# EAGLE design replicape-display (EAGLE 5.12)
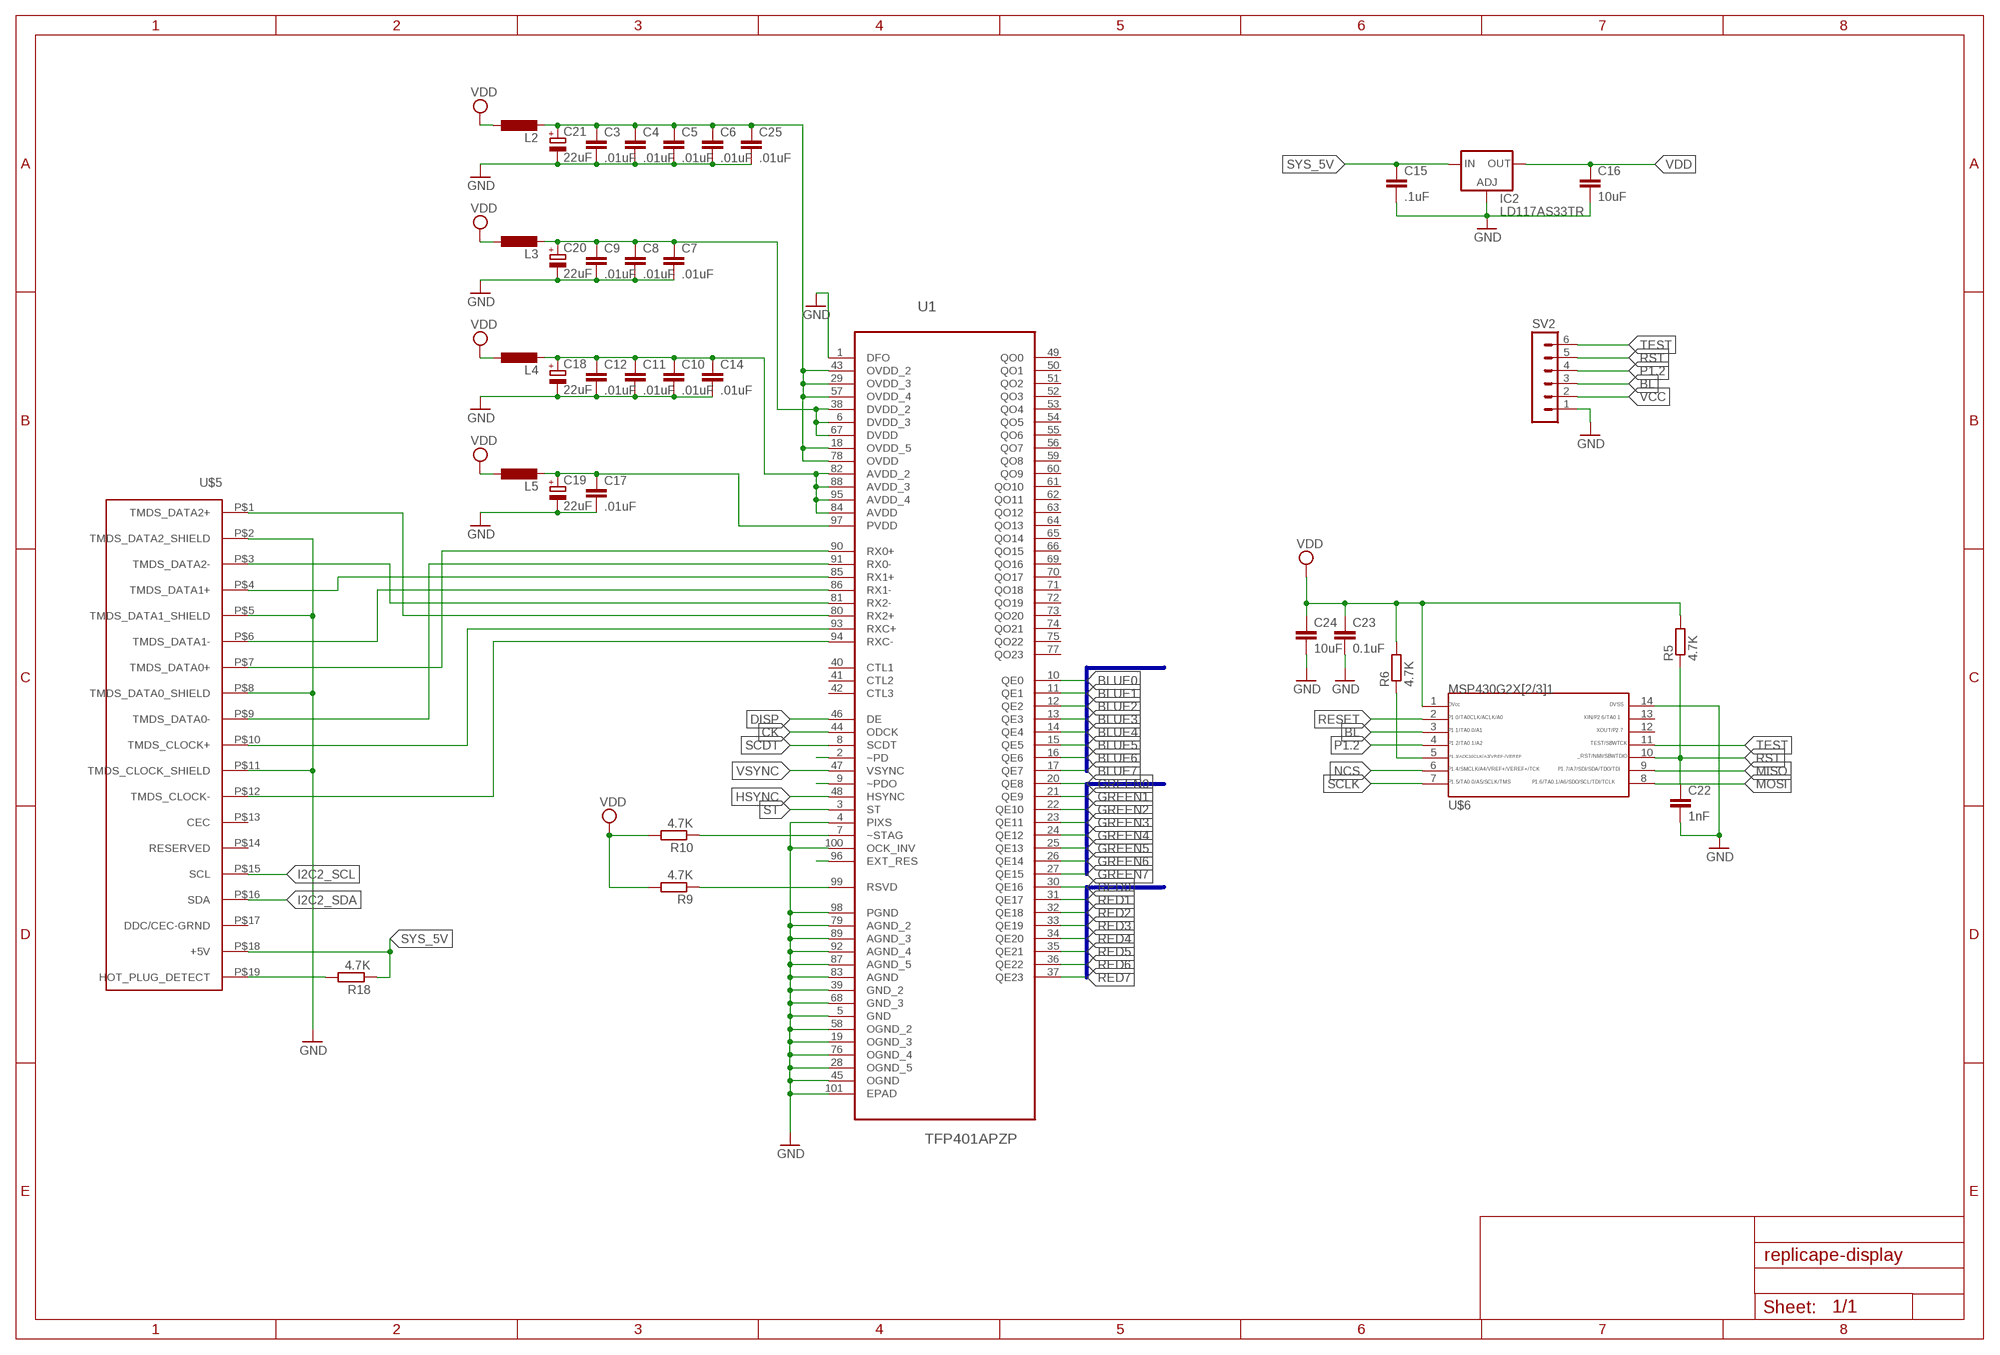
[diagram p0: schematic, sheet 1, part 1 of 2]
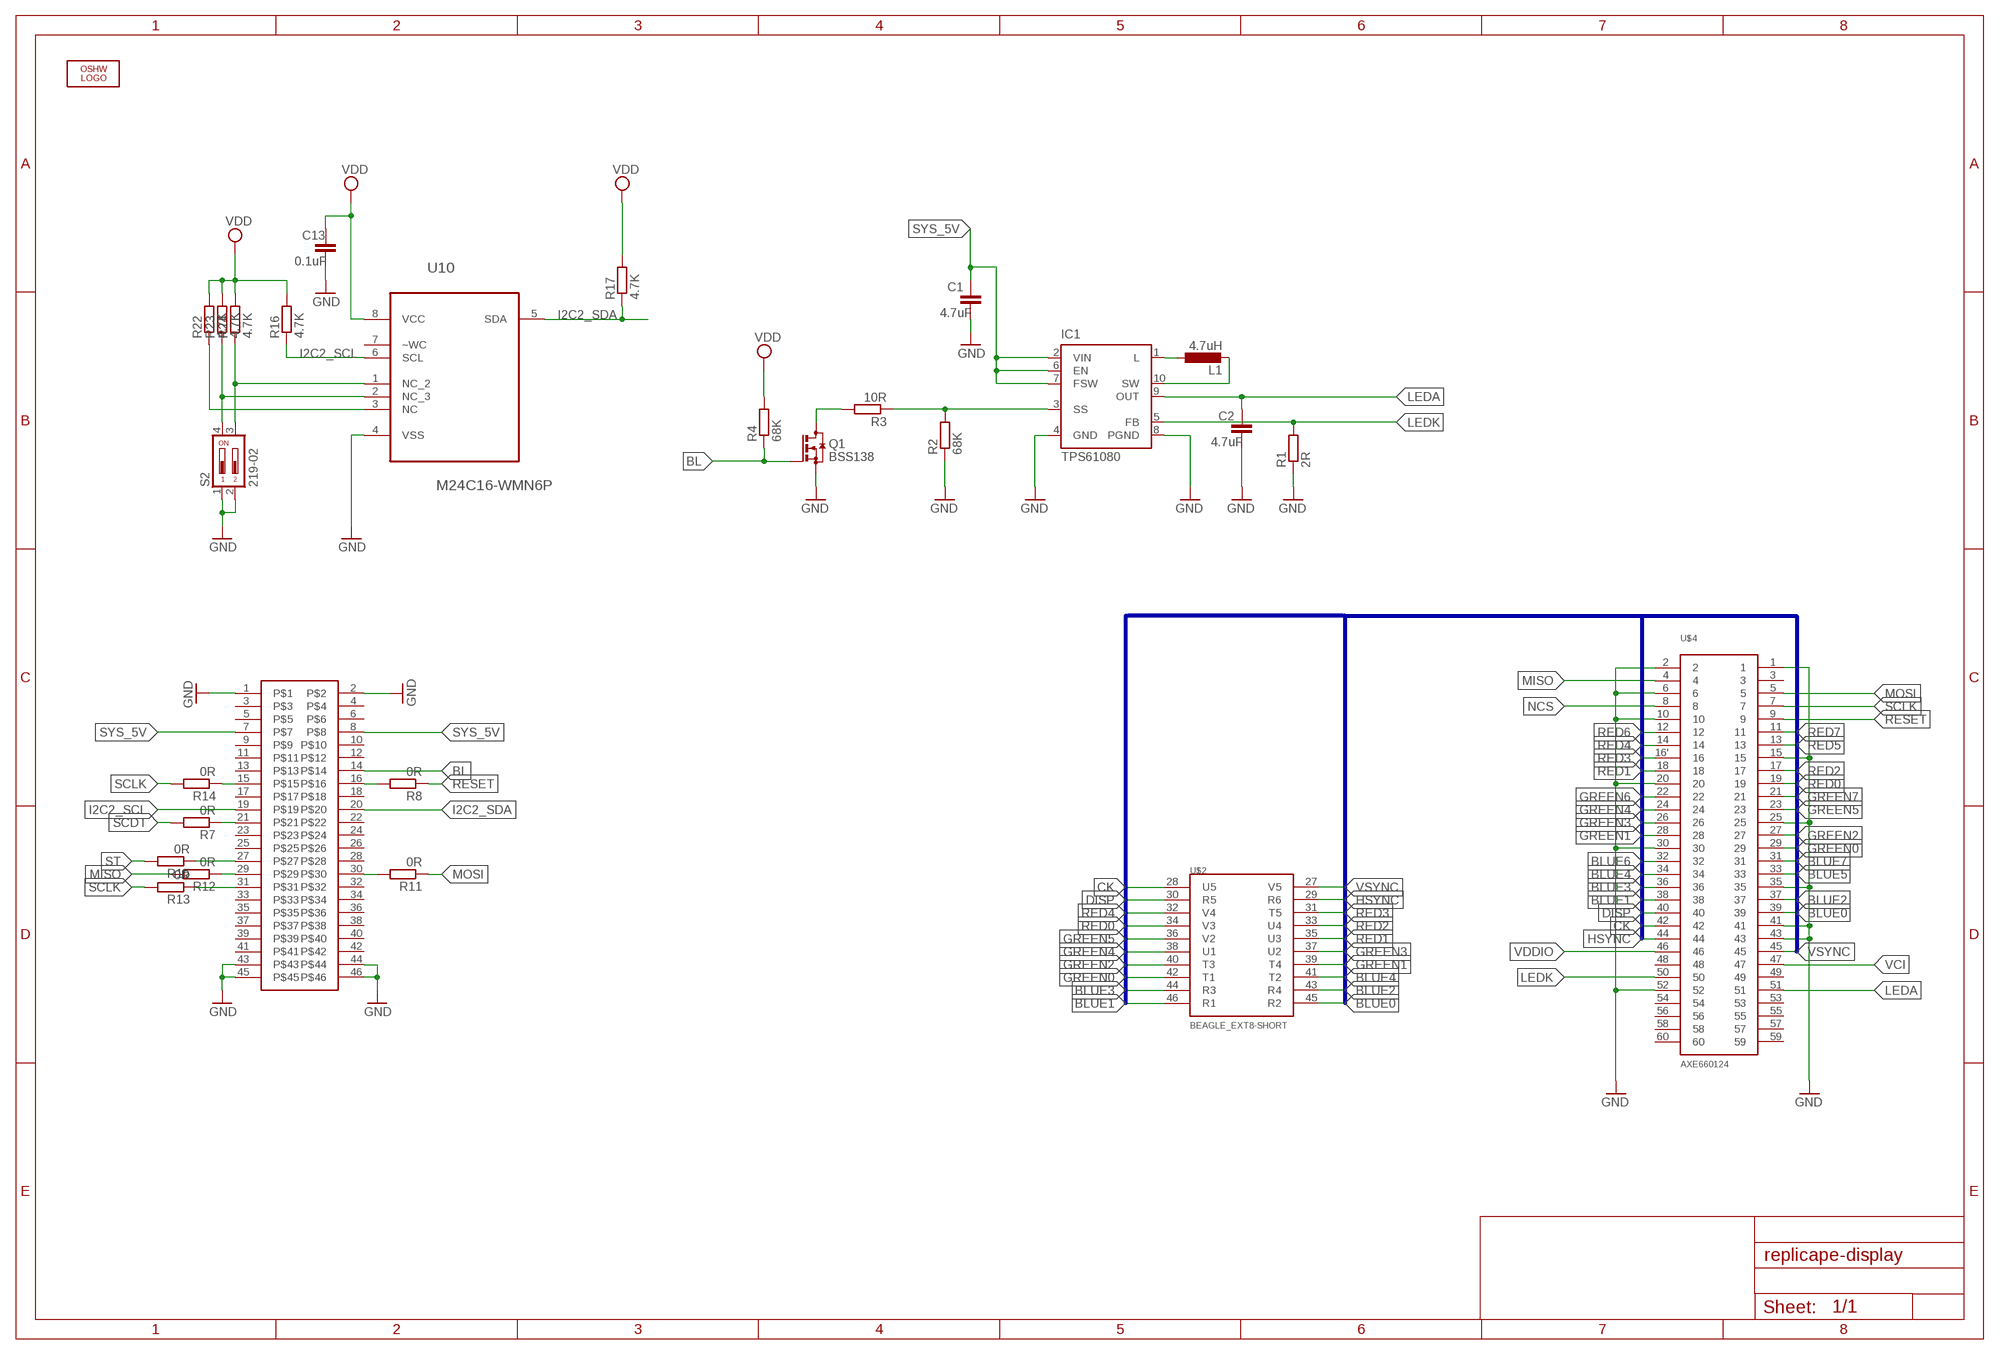
[diagram p1: schematic, sheet 1, part 2 of 2]

## Parts
C1  4.7uF  C-EUC0402  [C0402]
C2  4.7uF  C-EUC0402  [C0402]
C3  .01uF  C-EUC0402  [C0402]
C4  .01uF  C-EUC0402  [C0402]
C5  .01uF  C-EUC0402  [C0402]
C6  .01uF  C-EUC0402  [C0402]
C7  .01uF  C-EUC0402  [C0402]
C8  .01uF  C-EUC0402  [C0402]
C9  .01uF  C-EUC0402  [C0402]
C10  .01uF  C-EUC0402  [C0402]
C11  .01uF  C-EUC0402  [C0402]
C12  .01uF  C-EUC0402  [C0402]
C13  0.1uF  C-EUC0402  [C0402]
C14  .01uF  C-EUC0402  [C0402]
C15  .1uF  C-EUC0402  [C0402]
C16  10uF  C-EUC0805  [C0805]
C17  .01uF  C-EUC0402  [C0402]
C18  22uF  CPOL-EUCT7343  [CT7343]
C19  22uF  CPOL-EUCT7343  [CT7343]
C20  22uF  CPOL-EUCT7343  [CT7343]
C21  22uF  CPOL-EUCT7343  [CT7343]
C22  1nF  C-EUC0402  [C0402]
C23  0.1uF  C-EUC0402  [C0402]
C24  10uF  C-EUC0402  [C0402]
C25  .01uF  C-EUC0402  [C0402]
IC1  TPS61080  [S-PDSO-N10]
IC2  LD117AS33TR  [SOT223]
L1  4.7uH  L-EUL2825P  [L2825P]
L2  L-EUL2012C  [L2012C]
L3  L-EUL2012C  [L2012C]
L4  L-EUL2012C  [L2012C]
L5  L-EUL2012C  [L2012C]
LOGO1  OSHW_LOGO_10MILX0500-NT  [OSHW_10X500_NOTEXT]
Q1  BSS138  BSS123  [SOT23]
R1  2R  R-EU_R0402  [R0402]
R2  68K  R-EU_R0402  [R0402]
R3  10R  R-EU_R0402  [R0402]
R4  68K  R-EU_R0402  [R0402]
R5  4.7K  R-EU_R0402  [R0402]
R6  4.7K  R-EU_R0402  [R0402]
R7  0R  R-EU_R0402  [R0402]
R8  0R  R-EU_R0402  [R0402]
R9  4.7K  R-EU_R0402  [R0402]
R10  4.7K  R-EU_R0402  [R0402]
R11  0R  R-EU_R0402  [R0402]
R12  0R  R-EU_R0402  [R0402]
R13  0R  R-EU_R0402  [R0402]
R14  0R  R-EU_R0402  [R0402]
R15  0R  R-EU_R0402  [R0402]
R16  4.7K  R-EU_R0402  [R0402]
R17  4.7K  R-EU_R0402  [R0402]
R18  4.7K  R-EU_R0402  [R0402]
R22  4.7K  R-EU_R0402  [R0402]
R23  4.7K  R-EU_R0402  [R0402]
R24  4.7K  R-EU_R0402  [R0402]
S2  219-02  [CTS-219-02]
SV2  MA06-1  [MA06-1]
U1  TFP401APZP  [QFP50P1600X1600X120-101N]
U10  M24C16-WMN6P  [SOIC127P600X175-8N]
U$2  BEAGLE_EXT8-SHORT  [2X10]
U$3  BEAGLE_EXT9RECEPTACLES  [2X23-R]
U$4  AXE660124  [AXE660124]
U$5  HDMI-TYPE-A-RECEPTICALFCI10029449  [FCI-HDMI-TYPE-A-RECEPT]
U$6  G2X[2/3]1---PW14  [PW14]

## Nets
BL: Q1.1(G) R4.1 SV2.3 U$3.14 U$6.3
BLUE0: U1.10(QE0) U$2.45(R2) U$4.39
BLUE1: U1.11(QE1) U$2.46(R1) U$4.38
BLUE2: U1.12(QE2) U$2.43(R4) U$4.37
BLUE3: U1.13(QE3) U$2.44(R3) U$4.36
BLUE4: U1.14(QE4) U$2.41(T2) U$4.34
BLUE5: U1.15(QE5) U$4.33
BLUE6: U1.16(QE6) U$4.32
BLUE7: U1.17(QE7) U$4.31
CK: U1.44(ODCK) U$2.28(U5) U$4.42
DISP: U1.46(DE) U$2.30(R5) U$4.40
GND: C1.2 C2.2 C3.2 C4.2 C5.2 C6.2 C7.2 C8.2 C9.2 C10.2 C11.2 C12.2 C13.2 C14.2 C15.2 C16.2 C17.2 C18.- C19.- C20.- C21.- C22.2 C23.2 C24.2 C25.2 IC1.4(GND) IC1.8(PGND) IC2.1(ADJ) Q1.2(S) R1.1 R2.1 S2.1 S2.2 SV2.1 U1.1(DFO) U1.4(PIXS) U1.5(GND) U1.19(OGND_3) U1.28(OGND_5) U1.39(GND_2) U1.45(OGND) U1.58(OGND_2) U1.68(GND_3) U1.76(OGND_4) U1.79(AGND_2) U1.83(AGND) U1.87(AGND_5) U1.89(AGND_3) U1.92(AGND_4) U1.98(PGND) U1.100(OCK_INV) U1.101(EPAD) U10.4(VSS) U$3.1 U$3.2 U$3.43 U$3.44 U$3.45 U$3.46 U$4.1 U$4.2 U$4.6 U$4.10 U$4.15 U$4.20 U$4.25 U$4.30 U$4.35 U$4.41 U$4.43 U$4.52 U$5.P$2(TMDS_DATA2_SHIELD) U$5.P$5(TMDS_DATA1_SHIELD) U$5.P$8(TMDS_DATA0_SHIELD) U$5.P$11(TMDS_CLOCK_SHIELD) U$6.14
GREEN0: U1.20(QE8) U$2.42(T1) U$4.29
GREEN1: U1.21(QE9) U$2.39(T4) U$4.28
GREEN2: U1.22(QE10) U$2.40(T3) U$4.27
GREEN3: U1.23(QE11) U$2.37(U2) U$4.26
GREEN4: U1.24(QE12) U$2.38(U1) U$4.24
GREEN5: U1.25(QE13) U$2.36(V2) U$4.23
GREEN6: U1.26(QE14) U$4.22
GREEN7: U1.27(QE15) U$4.21
HSYNC: U1.48(HSYNC) U$2.29(R6) U$4.44
I2C2_SCL: R16.1 U10.6(SCL) U$3.19 U$5.P$15(SCL)
I2C2_SDA: R17.1 U10.5(SDA) U$3.20 U$5.P$16(SDA)
LEDA: C2.1 IC1.9(OUT) U$4.51
LEDK: IC1.5(FB) R1.2 U$4.50
MISO: R12.2 U$4.4 U$6.9
MOSI: R11.1 U$4.5 U$6.8
N$1: IC1.1(L) L1.1
N$2: IC1.10(SW) L1.2
N$3: U1.2(~PD)
N$4: IC1.3(SS) R2.2 R3.1
N$5: U1.9(~PDO)
N$6: Q1.3(D) R3.2
N$7: R7.1 U$3.21
N$8: R8.2 U$3.16
N$9: R6.1 U$6.5
N$10: R10.1 U1.7(~STAG)
N$11: R9.1 U1.99(RSVD)
N$12: R11.2 U$3.30
N$13: R12.1 U$3.29
N$14: U1.80(RX2+) U$5.P$1(TMDS_DATA2+)
N$16: R13.1 U$3.31
N$18: R14.1 U$3.15
N$19: C7.1 C8.1 C9.1 C20.+ L3.2 U1.6(DVDD_3) U1.38(DVDD_2) U1.67(DVDD)
N$20: C3.1 C4.1 C5.1 C6.1 C21.+ C25.1 L2.2 U1.18(OVDD_5) U1.29(OVDD_3) U1.43(OVDD_2) U1.57(OVDD_4) U1.78(OVDD)
N$21: C10.1 C11.1 C12.1 C14.1 C18.+ L4.2 U1.82(AVDD_2) U1.84(AVDD) U1.88(AVDD_3) U1.95(AVDD_4)
N$22: C17.1 C19.+ L5.2 U1.97(PVDD)
N$23: U1.96(EXT_RES)
N$29: R15.1 U$3.27
N$31: R18.2 U$5.P$19(HOT_PLUG_DETECT)
N$147: R24.1 S2.3 U10.1(NC_2)
N$148: R23.1 S2.4 U10.2(NC_3)
N$149: R22.1 U10.3(NC)
NCS: U$4.8 U$6.6
P1.2: SV2.4 U$6.4
RED0: U1.30(QE16) U$2.34(V3) U$4.19
RED1: U1.31(QE17) U$2.35(U3) U$4.18
RED2: U1.32(QE18) U$2.33(U4) U$4.17
RED3: U1.33(QE19) U$2.31(T5) U$4.16'
RED4: U1.34(QE20) U$2.32(V4) U$4.14
RED5: U1.35(QE21) U$4.13
RED6: U1.36(QE22) U$4.12
RED7: U1.37(QE23) U$4.11
RESET: R8.1 U$4.9 U$6.2
RST: C22.1 R5.1 SV2.5 U$6.10
SCDT: R7.2 U1.8(SCDT)
SCLK: R13.2 R14.2 U$4.7 U$6.7
ST: R15.2 U1.3(ST)
SYS_5V: C1.1 C15.1 IC1.2(VIN) IC1.6(EN) IC1.7(FSW) IC2.3(IN) R18.1 U$3.7 U$3.8 U$5.P$18(+5V)
TEST: SV2.6 U$6.11
TMDS_CLOCK+: U1.93(RXC+) U$5.P$10(TMDS_CLOCK+)
TMDS_CLOCK-: U1.94(RXC-) U$5.P$12(TMDS_CLOCK-)
TMDS_DATA0+: U1.90(RX0+) U$5.P$7(TMDS_DATA0+)
TMDS_DATA0-: U1.91(RX0-) U$5.P$9(TMDS_DATA0-)
TMDS_DATA1+: U1.85(RX1+) U$5.P$4(TMDS_DATA1+)
TMDS_DATA1-: U1.86(RX1-) U$5.P$6(TMDS_DATA1-)
TMDS_DATA2-: U1.81(RX2-) U$5.P$3(TMDS_DATA2-)
VCC: SV2.2
VCI: U$4.47
VDD: C13.1 C16.1 C23.1 C24.1 IC2.4(OUT) L2.1 L3.1 L4.1 L5.1 R4.2 R5.2 R6.2 R9.2 R10.2 R16.2 R17.2 R22.2 R23.2 R24.2 U10.8(VCC) U$6.1
VDDIO: U$4.46
VSYNC: U1.47(VSYNC) U$2.27(V5) U$4.45
Unconnected: IC1.PP(EXP) IC1.PP@1(EXP) IC1.PP@2(EXP) U1.40(CTL1) U1.41(CTL2) U1.42(CTL3) U1.49(QO0) U1.50(QO1) U1.51(QO2) U1.52(QO3) U1.53(QO4) U1.54(QO5) U1.55(QO6) U1.56(QO7) U1.59(QO8) U1.60(QO9) U1.61(QO10) U1.62(QO11) U1.63(QO12) U1.64(QO13) U1.65(QO14) U1.66(QO15) U1.69(QO16) U1.70(QO17) U1.71(QO18) U1.72(QO19) U1.73(QO20) U1.74(QO21) U1.75(QO22) U1.77(QO23) U10.7(~WC) U$3.3 U$3.4 U$3.5 U$3.6 U$3.9 U$3.10 U$3.11 U$3.12 U$3.13 U$3.17 U$3.18 U$3.22 U$3.23 U$3.24 U$3.25 U$3.26 U$3.28 U$3.32 U$3.33 U$3.34 U$3.35 U$3.36 U$3.37 U$3.38 U$3.39 U$3.40 U$3.41 U$3.42 U$4.3 U$4.48 U$4.49 U$4.53 U$4.54 U$4.55 U$4.56 U$4.57 U$4.58 U$4.59 U$4.60 U$5.P$13(CEC) U$5.P$14(RESERVED) U$5.P$17(DDC/CEC-GRND) U$6.12 U$6.13

## Buses
RED[0..7],BLUE[0..7],GREEN[0..7],HSYNC,VSYNC,CK,DISP
RED[0..7]
GREEN[0..7]
BLUE[0..7]

## Library data of the parts
C1-C17 C22-C25 = rcl:C-EU: CAPACITOR, European symbol
C18-C21 = rcl:CPOL-EU: POLARIZED CAPACITOR, European symbol
IC1 = texas:TPS6108*: HIGH VOLTAGE DC/DC BOOST CONVERTER WITH 0.5-A/1.3-A INTEGRATED SWITCH Source: www.ti.com .. tps61081[1].pdf; MPN: TPS61080DRCT; OC_FARNELL: 1412517; OC_NEWARK: 30M1831
IC2 = v-reg:LD117A?*: Low drop fixed and adjustable positive voltage regulators 1 A Source: http://www.st.com/stonline/products/literature/ds/7194/ld1117axx.pdf
L1-L5 = rcl:L-EU: INDUCTOR, European symbol
LOGO1 = ohw-logo:OSHW_LOGO_10MIL
Q1 = transistor-small-signal:BSS123: N-CHANNEL MOS FET
R1-R18 R22-R24 = rcl:R-EU_: RESISTOR, European symbol
S2 = switch-dil:219-02*: Surface Mount DIP Switch Series 219 SMT CTS Electronic Components Sourc: www.ctscorp.com; OC_FARNELL: unknown; OC_NEWARK: unknown
SV2 = con-lstb:MA06-1: PIN HEADER; OC_FARNELL: unknown; OC_NEWARK: unknown
U1 = ti-tfp401:TFP401APZP: DIGITAL RECEIVER; MPN: TFP401APZP; OC_FARNELL: 1470430; OC_NEWARK: 74K3959; PACKAGE: QFP-100; SUPPLIER: TEXAS INSTRUMENTS
U10 = custom:M24C16-WMN6P: serial I²C bus EEPROM; MPN: M24C16-WMN6P; OC_FARNELL: 9882774; OC_NEWARK: 24M5071; PACKAGE: SOIC-8; SUPPLIER: STMicroelectronics
U$2 = custom:BEAGLE_EXT8-SHORT
U$3 = custom:BEAGLE_EXT9
U$4 = replicape-display:AXE660124
U$5 = hdmi:HDMI-TYPE-A-RECEPTICAL
U$6 = TI_MSP430_v16:G2X[2/3]1---PW14: MSP430G2X[2/3]1 TSSOP (PW) 14 Pin Package http://focus.ti.com/docs/prod/folders/print/msp430g2221.html MSP430G2121, MSP430G2221, MSP430G2131

## Board
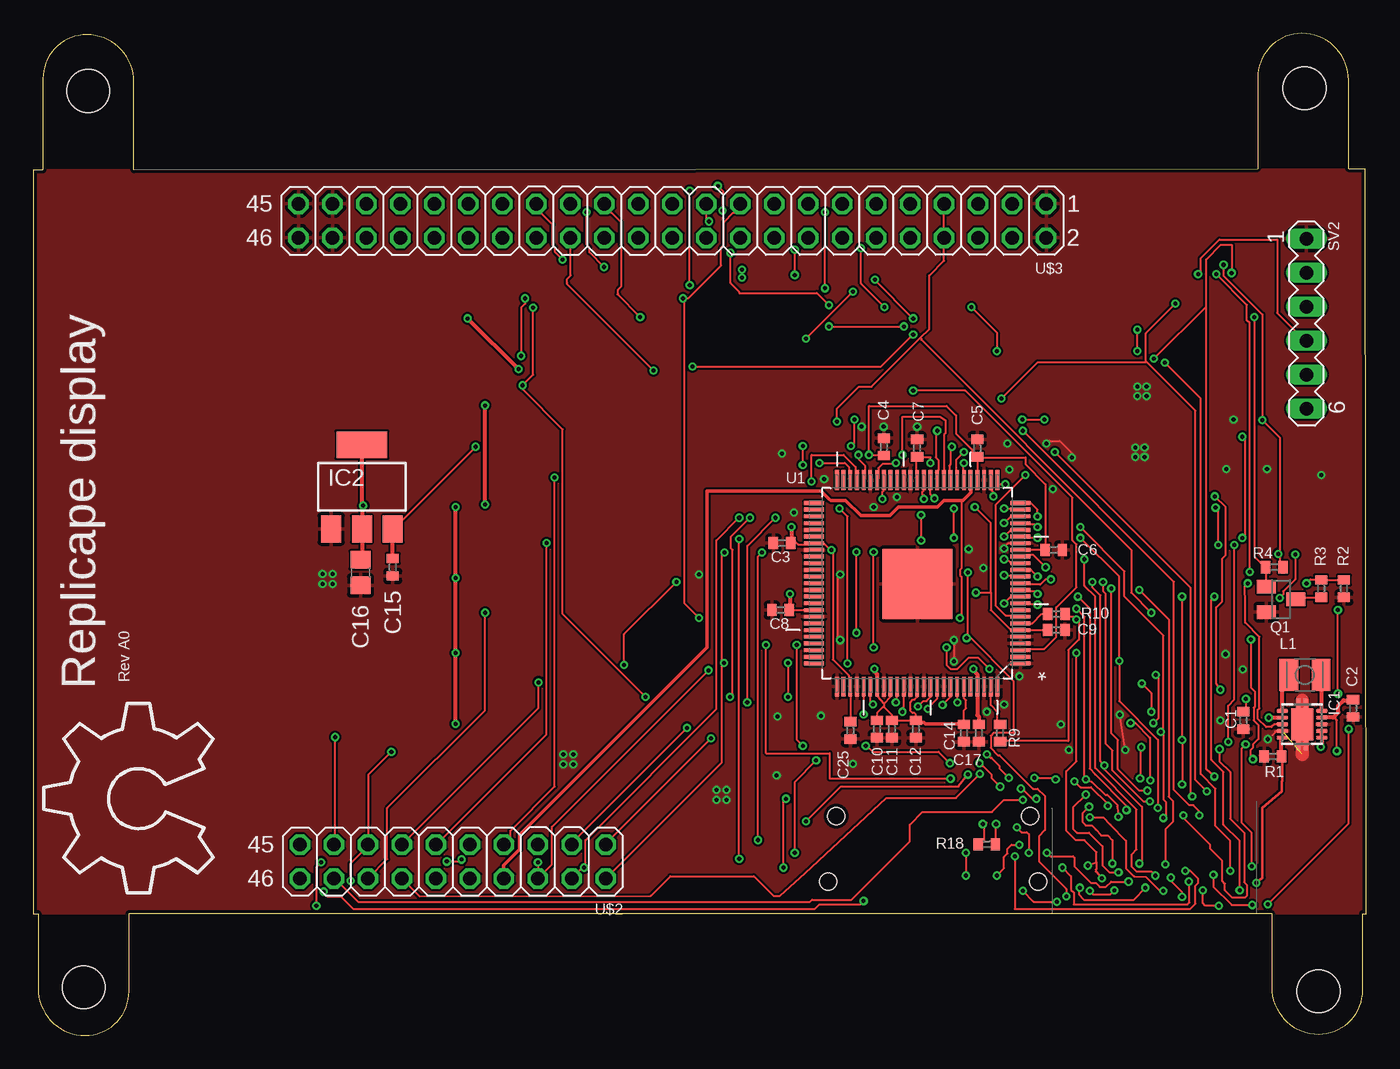
[diagram p2: board, top side]
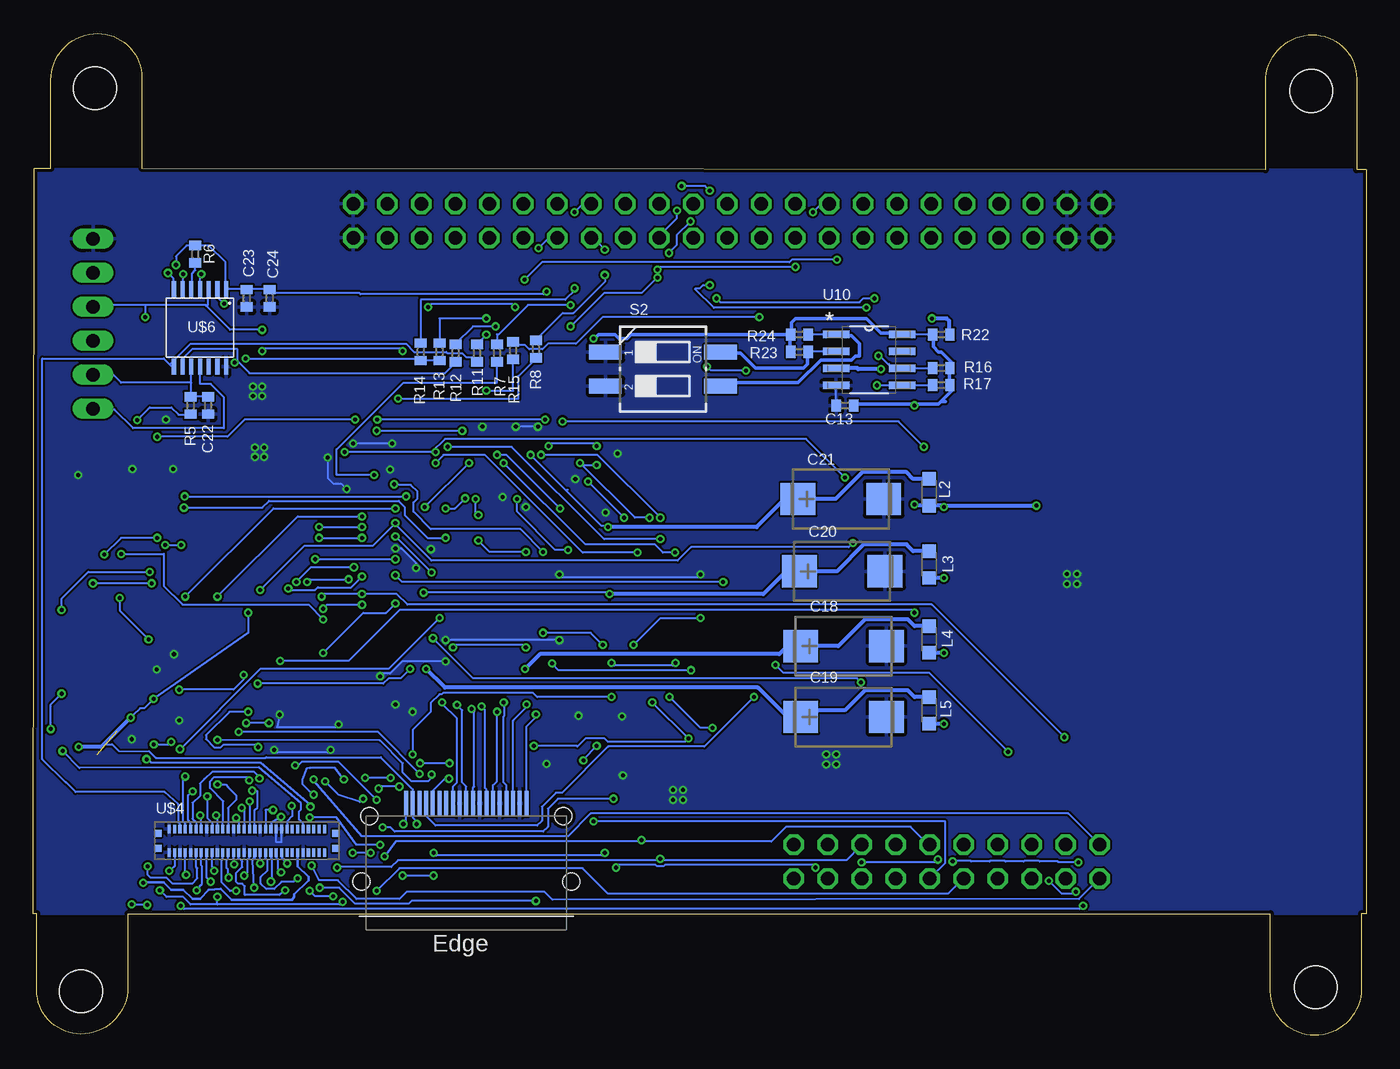
[diagram p3: board, bottom side, seen from below]

Size 99.6 x 74.9 mm. Coordinates in mm from the lower left corner, seen from the top.
Outline: 0,9.1 0.35,9.1 0.35,3.5 arc90 3.85,0 arc90 7.15,3.3 7.15,9.1 92.55,9.1 92.55,3.6 arc90 96.05,0.1 arc90 99.35,3.4 99.35,9.1 99.6,9.1 99.55,64.8 98.3,64.8 98.3,71.4 arc90 94.8,74.9 arc90 91.5,71.6 91.5,64.8 7.5,64.7 7.5,71.3 arc90 4,74.8 arc90 0.7,71.5 0.7,64.7 0,64.7 0,9.1
Copper layers (1*16): Top 0.035mm / dielectric 1.5mm / Bottom 0.035mm
Design rules "Fusion_eagle_rule_v1.1": minimum track width 6mil, minimum drill 12mil, track to track 6mil, track to pad 6mil, pad to pad 6mil, via to via 6mil, smd to smd 0mil, copper to edge 10mil, drill to drill 10mil, minimum pad ring 10mil, minimum via ring 6mil, stop-mask expansion 2mil, vias tented up to drill 100mil, thermal gap 10mil
Holes 3.2 mm at 4.1,70.6 3.75,3.6 95,70.8 96.05,3.3

### Footprints (pad centres in the part's own frame; a part is rotated, then mirrored left to right if it is on the bottom)
C0402 = smd 0.7 x 0.9: 1 -0.65,0; 2 0.65,0
C0805 = smd 1.3 x 1.5: 1 -0.95,0; 2 0.95,0
CT7343 = smd 2.6 x 2.4: + -3.2,0; - 3.2,0
S-PDSO-N10 = smd 0.28 x 0.85: 1 -1,-1.475; 2 -0.5,-1.475; 3 0,-1.475; 4 0.5,-1.475; 5 1,-1.475; 6 1,1.475; 7 0.5,1.475; 8 0,1.475; 9 -0.5,1.475; 10 -1,1.475 | smd 2.4 x 1.65: PP 0,0 | smd 3.8 x 0.28: PP@1 0,0.275; PP@2 0,-0.275
SOT223 = smd 1.5 x 2: 1 -2.3,-3.15; 2 0,-3.15; 3 2.3,-3.15 | smd 3.8 x 2: 4 0,3.15
L2825P = smd 1.4 x 2.4: 1 -1.2,0; 2 1.2,0
L2012C = smd 1 x 1: 1 -1,0; 2 1,0
SOT23 = smd 1 x 1.4: 1 -0.95,-1.1; 2 0.95,-1.1; 3 0,1.1
R0402 = smd 0.7 x 0.9: 1 -0.65,0; 2 0.65,0
CTS-219-02 = smd 1.13 x 2.44: 1 -1.27,-4.3; 2 1.27,-4.3; 3 1.27,4.3; 4 -1.27,4.3
MA06-1 = drill 1.016 long: 1 -6.35,0; 2 -3.81,0; 3 -1.27,0; 4 1.27,0; 5 3.81,0; 6 6.35,0
QFP50P1600X1600X120-101N = smd 1.473 x 0.279: 1 -7.722,5.994; 2 -7.722,5.512; 3 -7.722,5.004; 4 -7.722,4.496; 5 -7.722,3.988; 6 -7.722,3.505; 7 -7.722,2.997; 8 -7.722,2.489; 9 -7.722,2.007; 10 -7.722,1.499; 11 -7.722,0.991; 12 -7.722,0.508; 13 -7.722,0; 14 -7.722,-0.508; 15 -7.722,-0.991; 16 -7.722,-1.499; 17 -7.722,-2.007; 18 -7.722,-2.489; 19 -7.722,-2.997; 20 -7.722,-3.505; 21 -7.722,-3.988; 22 -7.722,-4.496; 23 -7.722,-5.004; 24 -7.722,-5.512; 25 -7.722,-5.994; 51 7.722,-5.994; 52 7.722,-5.512; 53 7.722,-5.004; 54 7.722,-4.496; 55 7.722,-3.988; 56 7.722,-3.505; 57 7.722,-2.997; 58 7.722,-2.489; 59 7.722,-2.007; 60 7.722,-1.499; 61 7.722,-0.991; 62 7.722,-0.508; 63 7.722,0; 64 7.722,0.508; 65 7.722,0.991; 66 7.722,1.499; 67 7.722,2.007; 68 7.722,2.489; 69 7.722,2.997; 70 7.722,3.505; 71 7.722,3.988; 72 7.722,4.496; 73 7.722,5.004; 74 7.722,5.512; 75 7.722,5.994 | smd 0.279 x 1.473: 26 -5.994,-7.722; 27 -5.512,-7.722; 28 -5.004,-7.722; 29 -4.496,-7.722; 30 -3.988,-7.722; 31 -3.505,-7.722; 32 -2.997,-7.722; 33 -2.489,-7.722; 34 -2.007,-7.722; 35 -1.499,-7.722; 36 -0.991,-7.722; 37 -0.508,-7.722; 38 0,-7.722; 39 0.508,-7.722; 40 0.991,-7.722; 41 1.499,-7.722; 42 2.007,-7.722; 43 2.489,-7.722; 44 2.997,-7.722; 45 3.505,-7.722; 46 3.988,-7.722; 47 4.496,-7.722; 48 5.004,-7.722; 49 5.512,-7.722; 50 5.994,-7.722; 76 5.994,7.722; 77 5.512,7.722; 78 5.004,7.722; 79 4.496,7.722; 80 3.988,7.722; 81 3.505,7.722; 82 2.997,7.722; 83 2.489,7.722; 84 2.007,7.722; 85 1.499,7.722; 86 0.991,7.722; 87 0.508,7.722; 88 0,7.722; 89 -0.508,7.722; 90 -0.991,7.722; 91 -1.499,7.722; 92 -2.007,7.722; 93 -2.489,7.722; 94 -2.997,7.722; 95 -3.505,7.722; 96 -3.988,7.722; 97 -4.496,7.722; 98 -5.004,7.722; 99 -5.512,7.722; 100 -5.994,7.722 | smd 5.207 x 5.207: 101 -0.025,0.051
SOIC127P600X175-8N = smd 1.981 x 0.533: 1 -2.464,1.905; 2 -2.464,0.635; 3 -2.464,-0.635; 4 -2.464,-1.905; 5 2.464,-1.905; 6 2.464,-0.635; 7 2.464,0.635; 8 2.464,1.905
2X10 = drill 1.016 octagon: 27 -11.43,-1.27; 28 -11.43,1.27; 29 -8.89,-1.27; 30 -8.89,1.27; 31 -6.35,-1.27; 32 -6.35,1.27; 33 -3.81,-1.27; 34 -3.81,1.27; 35 -1.27,-1.27; 36 -1.27,1.27; 37 1.27,-1.27; 38 1.27,1.27; 39 3.81,-1.27; 40 3.81,1.27; 41 6.35,-1.27; 42 6.35,1.27; 43 8.89,-1.27; 44 8.89,1.27; 45 11.43,-1.27; 46 11.43,1.27
2X23-R = drill 1.016 octagon: 1 -27.94,-1.27; 2 -27.94,1.27; 3 -25.4,-1.27; 4 -25.4,1.27; 5 -22.86,-1.27; 6 -22.86,1.27; 7 -20.32,-1.27; 8 -20.32,1.27; 9 -17.78,-1.27; 10 -17.78,1.27; 11 -15.24,-1.27; 12 -15.24,1.27; 13 -12.7,-1.27; 14 -12.7,1.27; 15 -10.16,-1.27; 16 -10.16,1.27; 17 -7.62,-1.27; 18 -7.62,1.27; 19 -5.08,-1.27; 20 -5.08,1.27; 21 -2.54,-1.27; 22 -2.54,1.27; 23 0,-1.27; 24 0,1.27; 25 2.54,-1.27; 26 2.54,1.27; 27 5.08,-1.27; 28 5.08,1.27; 29 7.62,-1.27; 30 7.62,1.27; 31 10.16,-1.27; 32 10.16,1.27; 33 12.7,-1.27; 34 12.7,1.27; 35 15.24,-1.27; 36 15.24,1.27; 37 17.78,-1.27; 38 17.78,1.27; 39 20.32,-1.27; 40 20.32,1.27; 41 22.86,-1.27; 42 22.86,1.27; 43 25.4,-1.27; 44 25.4,1.27; 45 27.94,-1.27; 46 27.94,1.27
AXE660124 = smd 0.23 x 0.65: 1 -5.8,0.875; 2 -5.8,-0.875; 3 -5.4,0.875; 4 -5.4,-0.875; 5 -5,0.875; 6 -5,-0.875; 7 -4.6,0.875; 8 -4.6,-0.875; 9 -4.2,0.875; 10 -4.2,-0.875; 11 -3.8,0.875; 12 -3.8,-0.875; 13 -3.4,0.875; 14 -3.4,-0.875; 15 -3,0.875; 16' -3,-0.875; 17 -2.6,0.875; 18 -2.6,-0.875; 19 -2.2,0.875; 20 -2.2,-0.875; 21 -1.8,0.875; 22 -1.8,-0.875; 23 -1.4,0.875; 24 -1.4,-0.875; 25 -1,0.875; 26 -1,-0.875; 27 -0.6,0.875; 28 -0.6,-0.875; 29 -0.2,0.875; 30 -0.2,-0.875; 31 0.2,0.875; 32 0.2,-0.875; 33 0.6,0.875; 34 0.6,-0.875; 35 1,0.875; 36 1,-0.875; 37 1.4,0.875; 38 1.4,-0.875; 39 1.8,0.875; 40 1.8,-0.875; 41 2.2,0.875; 42 2.2,-0.875; 43 2.6,0.875; 44 2.6,-0.875; 45 3,0.875; 46 3,-0.875; 47 3.4,0.875; 48 3.4,-0.875; 49 3.8,0.875; 50 3.8,-0.875; 51 4.2,0.875; 52 4.2,-0.875; 53 4.6,0.875; 54 4.6,-0.875; 55 5,0.875; 56 5,-0.875; 57 5.4,0.875; 58 5.4,-0.875; 59 5.8,0.875; 60 5.8,-0.875 | smd 0.45 x 0.53: P$31 6.6,0.565; P$32 6.6,-0.565; P$63 -6.6,-0.565; P$64 -6.6,0.565
FCI-HDMI-TYPE-A-RECEPT = smd 1.9 x 0.3: P$1 -0.95,4.5; P$2 -0.95,4; P$3 -0.95,3.5; P$4 -0.95,3; P$5 -0.95,2.5; P$6 -0.95,2; P$7 -0.95,1.5; P$8 -0.95,1; P$9 -0.95,0.5; P$10 -0.95,0; P$11 -0.95,-0.5; P$12 -0.95,-1; P$13 -0.95,-1.5; P$14 -0.95,-2; P$15 -0.95,-2.5; P$16 -0.95,-3; P$17 -0.95,-3.5; P$18 -0.95,-4; P$19 -0.95,-4.5 | hole 1.3: 0,7.25; 0,-7.25; 4.9,7.85; 4.9,-7.85
PW14 = smd 0.3 x 1.2: 1 -1.95,-2.9; 2 -1.3,-2.9; 3 -0.65,-2.9; 4 0,-2.9; 5 0.65,-2.9; 6 1.3,-2.9; 7 1.95,-2.9; 8 1.95,2.9; 9 1.3,2.9; 10 0.65,2.9; 11 0,2.9; 12 -0.65,2.9; 13 -1.3,2.9; 14 -1.95,2.9

### Placement (x,y rotation side)
C1  90.43,23.56 270 top
C2  98.63,24.46 270 top
C3  55.95,36.8 180 top
C4  63.55,44 90 top
C5  70.55,43.9 90 top
C6  76.25,36.3 0 top
C7  66.05,43.9 90 top
C8  55.85,31.8 180 top
C9  76.45,30.3 0 top
C10  63.05,22.9 270 top
C11  64.15,22.9 270 top
C12  65.95,22.9 270 top
C13  38.95,47.1 180 bottom
C14  69.55,22.6 270 top
C15  26.85,35 270 top
C16  24.45,34.6 270 top
C17  70.65,22.6 270 top
C18  39.05,29.1 0 bottom
C19  39.05,23.8 0 bottom
C20  39.15,34.7 0 bottom
C21  39.25,40.1 0 bottom
C22  86.55,47.1 270 bottom
C23  83.65,55.1 270 bottom
C24  81.95,55.1 270 bottom
C25  61.05,22.8 270 top
IC1  94.83,23.26 270 top
IC2  24.55,41 0 top
L1  95.03,26.96 0 top
L2  32.65,40.6 90 bottom
L3  32.65,35.2 90 bottom
L4  32.65,29.6 90 bottom
L5  32.65,24.3 90 bottom
LOGO1  13.45,10.65 90 top
Q1  93.25,32.6 270 top
R1  92.63,20.86 0 top
R2  97.95,33.4 90 top
R3  96.25,33.4 270 top
R4  92.75,35 0 top
R5  87.85,47.1 270 bottom
R6  87.5,58.4 90 bottom
R7  64.95,51 270 bottom
R8  62.05,51.3 90 bottom
R9  72.25,22.6 270 top
R10  76.45,31.5 0 top
R11  66.45,51 90 bottom
R12  68.05,51 270 bottom
R13  69.25,51.1 270 bottom
R14  70.65,51.1 270 bottom
R15  63.75,51.2 270 bottom
R16  31.75,49.9 0 bottom
R17  31.75,48.6 0 bottom
R18  71.25,14.3 0 top
R22  31.75,52.4 180 bottom
R23  42.35,51.1 180 bottom
R24  42.35,52.4 180 bottom
S2  52.55,49.8 270 bottom
SV2  95.15,53.2 270 top
U1  66.05,33.8 180 top
U10  37.15,50.5 0 bottom
U$2  31.35,13 180 top
U$3  47.75,60.9 180 top
U$4  83.65,14.55 0 bottom
U$5  67.25,16.4 270 bottom
U$6  87.15,52.9 180 bottom

### Tracks (layer width: path | path; a pad name or v marks a point on that pad's centre or on a via)
BL  (via drill 0.3)
  Top 0.152: Q1.1 92.1,33.55 R4.1 92.05,35 91.25,35.8 v91.25,53.7 | v61.85,58.85 61.85,56.2 v63.6,54.45 | v70.1,54.45 72,52.55 v72,51.15 | v82.5,51.15 v82.5,52.75
  Bottom 0.152: 91.25,54.6 95.05,54.6 95.15,54.5 SV2.3 | 86.7,54.6 91.25,54.6 | 86.7,54.6 86.55,54.6 86.55,55.8 U$6.3 | 91.25,54.6 v91.25,53.7 | v61.85,58.85 61.05,59.65 60.45,59.65 U$3.14 | v63.6,54.45 63.8,54.65 69.9,54.65 v70.1,54.45 | v72,51.15 72.2,51.35 82.3,51.35 v82.5,51.15 | v82.5,52.75 84.9,52.75 86.7,54.55 86.7,54.6
BLUE0  (via drill 0.3)
  Top 0.152: 79.1,18.95 78.55,19 78.55,31.3 v77.95,31.9 | 79.1,18.95 80.1,18 80.25,18 81,17.25 81,17.1 v81.1,16.35 | v75.05,32.2 73.85,32.2 73.85,32.3 U1.10 | v78.65,19.15 79.1,18.95
  Bottom 0.152: v77.95,31.9 77.65,32.2 v75.05,32.2 | v81.1,16.35 81.85,15.9 U$4.39 | v78.65,19.15 78.65,19.05 75.05,14.9 59.65,14.9 57.95,16.6 22.25,16.6 U$2.45
BLUE1  (via drill 0.3)
  Top 0.152: 79.45,12.95 79.45,13.7 78.55,14.6 77.9,14.6 77.2,15.3 77.2,19.75 77.95,20.5 v77.95,28.6 | 79.45,12.95 79.45,12.45 79.4,12.4 79.4,12.25 v79.85,11.75 | v72.55,32.3 73.05,32.8 73.75,32.8 U1.11 | v78.8,12.7 79.45,12.95
  Bottom 0.152: v79.85,11.75 80.15,11.5 81.05,11.5 81.6,10.95 82.2,10.95 82.6,11.35 82.6,11.85 82.1,12.35 82.1,13.1 82.25,13.25 U$4.38 | v77.95,28.6 74.95,31.6 73.25,31.6 v72.55,32.3 | v78.8,12.7 78.25,11.6 76.85,11.6 75.45,10.2 72.25,10.2 71.7,10.75 61.4,10.75 60.8,10.15 21.45,10.2 U$2.46
BLUE2  (via drill 0.3)
  Top 0.152: v81.7,16.85 81.7,17.15 79.35,19.5 78.95,19.95 78.95,31.9 v78.05,32.8 | v75.05,33 74.85,33.2 73.85,33.2 U1.12 | v22.55,22.3 22.55,14.3 U$2.43
  Bottom 0.152: U$4.37 82.25,16.85 v81.7,16.85 | v78.05,32.8 77.85,33 v75.05,33 72.45,33 71.65,32.2 32.45,32.2 v22.55,22.3
BLUE3  (via drill 0.3)
  Top 0.152: v82.65,12.85 82.85,13.1 82.85,17.1 80.05,19.9 v80.05,20.2 79.75,20.5 79.75,32.9 79.15,33.5 v79.15,33.9 | v76.05,34.1 75.65,34.1 75.25,33.7 73.85,33.7 73.85,33.8 U1.13 | v73.95,17.6 72.55,17.6 71.65,16.7 66.45,16.7 65.5,15.75 65.5,14.5 61.15,10.15 58.2,10.15 58.05,10 24.25,10 22.55,11.7 U$2.44
  Bottom 0.152: v79.15,33.9 78.95,34.1 v76.05,34.1 | v82.65,12.85 U$4.36 | v73.95,17.6 76.8,20.45 79.55,20.45 79.95,20.05 v80.05,20.2
BLUE4  (via drill 0.3)
  Top 0.152: v72.55,34.4 73.75,34.4 U1.14 | v48.05,33.9 44.15,30 v44.15,27.7 | v26.75,21.2 25.05,19.5 25.05,14.3 U$2.41 25,13.75 24.6,13.75 23.7,12.85 v23.7,11.55 | v21.7,10.75 21.7,10.65 21.95,10.4 22.95,10.4 23.9,9.45 58.4,9.45 58.75,9.8 61.8,9.8 v62.05,10.05 | v78.2,11.05 78.15,11 78.15,10.55 78.5,10.15 82.25,10.15 v83.1,11.05
  Bottom 0.152: v72.55,34.4 72.05,33.9 v48.05,33.9 | v44.15,27.7 43.55,27.1 32.65,27.1 v26.75,21.2 | v83.1,11.05 83.2,13.1 83.05,13.3 U$4.34 | v21.7,10.75 21.8,10.75 21.95,10.6 22.75,10.6 v23.7,11.55 | v62.05,10.05 71.35,10.05 71.55,9.85 75.55,9.85 76.75,11.05 v78.2,11.05
BLUE5  (via drill 0.3)
  Top 0.152: v83.25,18.3 82.65,18.3 81.05,19.9 81.05,22.09 80.55,22.59 v80.55,33.4 | v75.05,34.3 74.55,34.8 73.85,34.8 U1.15
  Bottom 0.152: v83.25,18.3 82.85,18.25 82.85,17.05 83.05,16.85 U$4.33 | v80.55,33.4 80.45,33.3 78.55,33.3 78.35,33.5 75.85,33.5 v75.05,34.3
BLUE6  (via drill 0.3)
  Top 0.152: v83.85,11.95 83.55,12.25 82.45,12.25 82.1,12.6 82.1,13.55 82.45,13.9 82.45,16.9 79.35,20 79.35,32.8 78.55,33.6 v78.55,35.6 | v72.55,35.6 72.75,35.6 73.05,35.3 73.75,35.3 U1.16
  Bottom 0.152: v83.85,11.95 83.6,12.2 83.6,13.15 83.45,13.3 U$4.32 | v78.55,35.6 v72.55,35.6
BLUE7  (via drill 0.3)
  Top 0.152: v83.45,17.5 82.95,17.5 80.65,19.8 80.65,21.3 80.15,21.8 80.15,33 79.95,33.2 v79.95,33.9 | v75.65,35 74.75,35.9 73.85,35.9 U1.17
  Bottom 0.152: v79.95,33.9 78.85,35 v75.65,35 | v83.45,17.5 U$4.31
CK  (via drill 0.3)
  Top 0.152: v64.45,42.8 64.35,42.7 63.45,42.7 63.15,42.4 63.15,41.6 U1.44 | v51.65,36.1 51.45,35.9 51.45,27.85 | 51.45,27.85 51.45,20.4 U$2.28 | v81.1,12.2 80.4,12.2 79.9,12.7 79.9,14.15 78.9,15.15 78,15.15 77.7,15.45 77.7,17.05 v78.65,18 | v56.4,27.85 v56.4,25.3 | v71.25,21 71.3,20.95 71.35,20.95 71.55,20.75 71.6,20.75 72.2,20.15 72.2,19.95 v72.9,19.25 | v74.8,19.25 76.3,19.25 v76.4,19.15 | 51.45,27.85 v51.6,27.85
  Bottom 0.152: v64.45,42.8 58.35,36.7 53.15,36.7 52.55,36.1 v51.65,36.1 | v81.1,12.2 81.3,12.4 81.3,13.15 81.45,13.3 U$4.42 | v51.6,27.85 51.8,27.65 56.2,27.65 v56.4,27.85 | v56.4,25.3 61.95,25.3 62.25,25.6 69,25.6 69.1,25.5 69.25,25.5 69.9,24.85 69.9,24.2 71.25,22.85 v71.25,21 | v72.9,19.25 v74.8,19.25 | v76.4,19.15 77.05,20 78.95,20 79.2,19.95 79.5,19.1 79.5,18.8 79,18.3 v78.65,18
DISP  (via drill 0.3)
  Top 0.152: v61.65,43.4 61.65,43.1 62.15,42.6 62.15,41.6 U1.46 | v52.75,38.7 51.05,37 51.05,24.4 41.25,14.6 41.25,12.8 41.1,12.65 | 41.1,12.65 40.25,11.8 U$2.30 | v81.85,11.5 80.55,11.5 80.15,11.1 79.7,11.1 79.4,11.4 79.05,11.4 77.8,12.65 77.8,13.3 77.7,13.4 76,13.4 v75.75,13.65 | v41.15,12.55 41.15,12.6 41.1,12.65 | v56.05,12.55 56.05,17.5 v56.25,17.7 | v73.5,15.55 73.85,15.2 74.25,15.2 74.4,15.05 v74.4,13.65
  Bottom 0.152: v61.65,43.4 57.45,43.4 v52.75,38.7 | v81.85,11.5 81.75,11.6 81.75,13.2 81.85,13.3 U$4.40 | v41.15,12.55 41.35,12.75 52.4,12.75 52.5,12.65 53,12.65 53.1,12.75 55.85,12.75 v56.05,12.55 | v56.25,17.7 60.4,17.7 61.15,16.95 61.15,15.6 61.5,15.25 72.6,15.25 72.9,15.55 v73.5,15.55 | v74.4,13.65 v75.75,13.65
GND  (via drill 0.3)  (1 unrouted)
  Top 0.152: 92.63,22.46 92.83,22.66 92.83,22.76 IC1.4 | v81.6,21.35 v81.2,23.98 | v77.4,21.35 77.6,21.15 | v68.8,29.55 v68.8,27.95 | v60.3,29.55 60.1,29.75 60.1,34.25 v60.3,34.45 | v77.6,43.2 77.6,43.55 76.7,44.45 75.9,44.45 v75.7,44.25 | v72.55,36.4 72.55,36.5 72.85,36.8 73.75,36.8 U1.19
  Top 1: 94.83,21.01 94.83,25.06
  Bottom 0.152: C13.2 39.61,47.1 U10.4 | v76.8,23.25 77,23.05 81.4,23.05 v81.2,23.98 | v81.6,21.35 81.4,21.15 77.6,21.15 v77.4,21.35 | v73.7,26.85 73.5,27.05 72.95,27.05 72.05,27.95 v68.8,27.95 | v60.3,29.55 v68.8,29.55 | v60.3,34.45 60.1,34.25 49.95,34.25 v49.75,34.45 | v76.2,40.85 76.6,41.25 77.2,41.25 77.6,41.65 v77.6,43.2 | v72.8,44.25 v75.7,44.25 | v61.9,45.5 v63.55,45.5 | v72.55,36.4 72.1,36.4 71,35.3 v71,34.95 | U$4.41 81.45,14.45 81.05,14.45 81.05,15.4
  other vias: 69.9,36.35 61.25,20.3 55.55,19.45 51.05,18.35 55.6,23.85 58.85,23.9 64.55,40.25 72.95,42.3 92.25,22.15 88.7,23.55 89.15,42.35 92.2,42.35 96.25,41.9 90.4,27.35 89.1,28.5 66.05,45.5 62.8,39.5 59.1,41.6 56.85,39.1 55.95,43.5 89.7,46.05 83.2,48.5 83.2,47.8 82.5,47.8 82.5,48.5 83.05,43.95 83.05,43.25 82.35,43.25 82.35,43.95 72.55,24.75 71.25,24.2 51.8,18.35 51.8,17.6 51.05,17.6 39.6,21 40.35,21 40.35,20.25 39.6,20.25 21.6,34.5 22.35,34.5 22.35,33.75 21.6,33.75
  pour Bottom: 0,64.7 99.55,64.8 99.85,9.1 0,9.1
  pour Top: 0,64.7 99.55,64.8 99.85,9.1 0,9.1
GREEN0  (via drill 0.3)
  Top 0.152: v84.05,17 84.05,22.1 81.15,25 v81.15,28 81.15,34.3 v78.25,37.2 | v75.05,37.2 73.85,37.2 73.85,37.3 U1.20 | v33.75,31.6 33.75,24.3 26.45,17 26.45,13.2 25.05,11.8 U$2.42
  Bottom 0.152: v84.05,17 83.85,16.8 U$4.29 | v78.25,37.2 v75.05,37.2 | v33.75,31.6 33.95,31.8 72.25,31.8 76.05,28 v81.15,28
GREEN1  (via drill 0.3)
  Top 0.152: v78.95,10.8 79.2,10.55 80.5,10.55 v80.8,10.85 | v77.2,10.4 77.2,10.95 75.15,13 75.15,14.9 75.6,15.35 75.6,17.9 75.05,18.45 74.7,18.45 72.2,20.95 72.1,20.95 71.55,21.5 71.55,22.4 71.75,22.6 73.25,22.6 73.25,26.5 69.9,29.85 | 69.9,29.85 69.85,29.9 v69.85,34.6 | v72.55,37.3 73.05,37.8 73.75,37.8 U1.21 | v37.75,26.4 37.75,24.5 27.55,14.3 U$2.39 | v69.75,29.7 69.9,29.85
  Bottom 0.152: v80.8,10.85 81.2,10.5 83.8,10.5 83.8,11.15 84,11.35 84.3,11.35 84.45,11.5 84.45,12.15 84,12.6 84,13 84.25,13.25 U$4.28 | v78.95,10.8 78.55,10.4 v77.2,10.4 | v69.85,34.6 v72.55,37.3 | v37.75,26.4 38.05,26.7 66.75,26.7 v69.75,29.7
GREEN2  (via drill 0.3)
  Top 0.152: v84.45,16.25 84.65,16.45 84.65,17.45 84.45,17.65 84.45,22.7 | 84.45,22.7 84.45,29.9 81.55,32.8 81.55,34.7 v78.25,38 | v75.05,38 74.85,38.2 73.85,38.2 U1.22 | v70.75,19.55 68.95,17.75 63.75,17.75 57.65,12.1 55.8,10.45 55.3,10.45 53.85,11.9 47.6,11.9 46.15,10.45 28.85,10.4 27.55,11.7 U$2.40 | v84.25,22.7 84.45,22.7
  Bottom 0.152: v84.45,16.25 84.25,16.05 U$4.27 | v78.25,38 v75.05,38 | v70.75,19.55 73.85,22.7 v84.25,22.7
GREEN3  (via drill 0.3)
  Top 0.152: v84.6,12.8 84.6,15.4 85.15,15.95 85.15,17.55 84.85,17.85 84.85,31.1 v82.65,33.3 | v72.55,38.3 73.05,38.8 73.75,38.8 U1.23 | v38.35,36.8 38.35,22.5 30.15,14.3 U$2.37
  Bottom 0.152: v82.65,33.3 79.35,36.6 74.25,36.6 v72.55,38.3 72.55,38.2 69.85,35.5 51.45,35.5 50.45,36.5 38.65,36.5 v38.35,36.8 | v84.6,12.8 84.65,13 U$4.26
GREEN4  (via drill 0.3)
  Top 0.152: v90.15,10.85 90.15,14.55 88.95,15.75 88.95,19.7 88.05,20.6 88.05,32.6 v88.25,32.8 | v72.55,39.4 73.75,39.4 U1.24 | v73.95,10.8 74.75,10 v76.5,10 | v85.85,10.35 85.85,10.7 85,11.55 v85,11.8
  Bottom 0.152: v88.25,32.8 81.65,39.4 v72.55,39.4 | v73.95,10.8 72.25,12.5 58.55,12.5 56.65,10.6 31.25,10.6 30.15,11.7 U$2.38 | v76.5,10 76.7,9.8 85.85,9.8 | 85.85,9.8 87.85,9.8 88.4,10.35 89.65,10.35 v90.15,10.85 | v85,11.8 85.05,11.85 85.05,12.4 85.15,12.5 85.15,13.1 85.05,13.2 U$4.24 | 85.85,9.8 v85.85,10.35
GREEN5  (via drill 0.3)
  Top 0.152: v85.85,32.8 v85.85,22.1 v85.85,18.76 | v75.05,38.8 75.05,39.3 74.55,39.8 73.85,39.8 U1.25 | v57.75,16 60.35,18.6 69.15,18.6 v69.85,19.5
  Bottom 0.152: v85.85,18.76 85.28,18.76 85.24,18.76 85.04,18.55 84.8,18.3 84.45,17.95 84.45,17.6 85.05,17 U$4.23 | v85.85,32.8 79.85,38.8 v75.05,38.8 | v57.75,16 31.45,16 31.45,12.9 U$2.36 | v69.85,19.5 69.85,19.25 70.1,19 71.35,19 72,19.65 72,20.35 73.7,22.05 v85.85,22.1
GREEN6  (via drill 0.3)
  Top 0.152: v84.45,10.8 84.2,10.8 83.15,11.85 82.25,11.9 81.65,12.5 81.65,14.55 80.5,15.75 79.95,16.3 v78.95,16.3 | v72.65,41.2 72.05,41.2 72.05,41.5 U1.26 | v61.5,30.1 v61.5,36.15 | v57.05,29.2 57.05,22.1 v57.5,21.65 | v58.5,20.55 56.9,18.95 v56.9,13.65 | v69.7,13.65 v69.7,11.95 | v72,11.95 72.55,12.5 72.55,13.35 72.8,13.6 72.8,13.95 73.1,14.25 v73.7,14.25
  Bottom 0.152: U$4.22 85.45,13.2 85.55,13.1 85.55,11.45 84.9,10.8 v84.45,10.8 | v72.65,41.2 72.6,41.15 71.4,41.15 70.9,40.65 70.9,40.15 71.2,39.85 71.2,39.15 69.9,37.85 63.2,37.85 v61.5,36.15 | v61.5,30.1 57.95,30.1 v57.05,29.2 | v57.5,21.65 58.5,20.65 v58.5,20.55 | v56.9,13.65 57.1,13.45 69.5,13.45 v69.7,13.65 | v69.7,11.95 v72,11.95 | v73.7,14.25 75.45,14.25 76.95,16.3 78.8,16.3 79,16.5 v78.95,16.3
GREEN7  (via drill 0.3)
  Top 0.152: v83.47,19.06 83.47,22.11 83.45,22.25 82.35,23.35 v82,23.35 | v83.7,23.35 84.1,23.75 84.1,26.75 v83.9,26.95 | v88.7,25.85 88.4,26.3 88.4,32 88.85,32.45 88.85,35.65 89.1,35.9 89.1,39.5 v88.3,40.3 | v71.75,40.3 71.75,40.6 71.65,40.7 71.65,40.75 71.55,40.85 71.55,41.5 U1.27
  Bottom 0.152: U$4.21 85.45,15.95 85.4,16 85.4,17.51 86.4,18.5 86.4,18.99 86.08,19.31 83.62,19.31 v83.47,19.06 | v82,23.35 v83.7,23.35 | v83.9,26.95 83.9,26.6 84.65,25.85 v88.7,25.85 | v88.3,40.3 v71.75,40.3
HSYNC  (via drill 0.3)
  Top 0.152: v58.75,42.8 60.65,42.8 60.95,42.5 60.95,41.6 U1.48 | v53.55,38.7 52.15,37.3 52.15,36.4 52.25,36.3 52.25,25.5 v52.05,25.3 | v48.85,23 40.25,14.4 40.25,14.3 U$2.29 | v80.65,12.85 80.65,14.6 80.3,14.95 79.8,14.95 79.4,15.4 79.1,15.7 78.65,15.7 78.4,15.95 78.4,16.6 v78.9,17.1 | v57.5,42.65 v57.5,44.05 | v61.1,44.05 61.35,44.3 v61.35,46.05 | v73.9,46.05 v75.55,46.05 | v90.35,44.75 90.55,44.55 90.55,37.4 v90.35,37.2 | v94.3,35.95 94.3,34.1 93.4,33.2 93.4,32.95 v93.15,32.7 | v91,29.6 91,26 91.3,25.7 91.3,24.6 91.2,24.5 91.2,23.55 91.55,23.2 91.55,22.15 91.15,21.75 91.15,21.5 90.95,21.3 90.95,20.8 91.1,20.65 v91.15,20.65
  Bottom 0.152: v53.55,38.7 54.65,38.7 v58.75,42.8 58.5,42.65 v57.5,42.65 | v52.05,25.3 49.75,23 v48.85,23 | U$4.44 81,13.3 81,13.25 80.9,13.15 80.9,13.1 v80.65,12.85 | v57.5,44.05 57.7,44.25 60.9,44.25 v61.1,44.05 | v61.35,46.05 v73.9,46.05 | v75.55,46.05 83.8,46.05 85.1,44.75 v90.35,44.75 | v90.35,37.2 93.05,37.2 v94.3,35.95 | v93.15,32.7 93.15,31.75 v91,29.6 | v91.15,20.65 91.05,20.65 90.8,20.4 82.6,20.4 78.9,17.25 v78.9,17.1
I2C2_SCL  (via drill 0.3)
  Top 0.152: 48.65,55.1 48.95,55.1 51.4,57.55 51.4,58.9 51.6,59.1 51.6,60.8 52.3,61.5 52.8,61.5 52.85,61.55 52.85,62.15 U$3.19 | v36.75,55.1 36.75,54.7 36.45,54.4 v36.45,50.8 | v68.55,19.2 59.5,19.2 59.5,21.1 54.75,21.1 v54.75,29.2 | v49.75,31.2 48.65,32.3 48.65,55.1 | 48.65,55.1 v48.55,55.1
  Bottom 0.152: R16.1 34.69,49.9 U10.6 34.75,49.9 35.35,49.9 35.65,50.2 35.75,50.2 36.35,50.8 v36.45,50.8 | v48.55,55.1 48.25,54.8 37.85,54.8 37.55,55.1 v36.75,55.1 | v68.55,19.2 68.85,19.2 69.75,18.3 U$5.P$15 | v54.75,29.2 52.75,31.2 v49.75,31.2
I2C2_SDA  (via drill 0.3)
  Top 0.152: v37.35,54.4 37.35,49.4 v36.55,48.6 36.55,48.3 39.55,45.3 39.55,31.5 v45.75,25.3 | v51.5,61.65 51.5,62.7 51.55,62.75 51.55,63.1 v51.15,63.5 | v49.05,56.1 v49.05,63.15
  Bottom 0.152: R17.1 U10.5 34.75,48.6 v36.55,48.6 | v37.35,54.4 48.75,54.4 50.15,55.8 50.1,55.85 49.8,55.85 49.55,56.1 v49.05,56.1 | v45.75,25.3 49.45,21.6 56.65,21.6 60.1,18.15 60.55,18.15 61.6,17.1 61.6,16.05 61.95,15.7 69.55,15.7 70.25,16.4 U$5.P$16 | v51.5,61.65 51.55,61.6 51.55,61.05 52.4,60.2 52.4,59.65 52.8,59.65 U$3.20 | v51.15,63.5 49.4,63.5 v49.05,63.15
LEDA  (via drill 0.3)
  Top 0.152: v97.43,21.26 97.43,23.56 97.33,23.66 97.33,23.76 97.23,23.86
  Top 0.3: IC1.9 97.13,23.76 97.23,23.86 97.53,24.16 97.53,24.66 97.93,25.06 98.58,25.06 C2.1
  Bottom 0.152: v97.43,21.26 96.17,20 82.75,20.02 79.61,17.33 79.61,16.9 79.75,16.75 79.75,16.15 79.45,15.85 U$4.51
LEDK  (via drill 0.3)
  Top 0.152: 93.3,18.99 93.33,19.02
  Top 0.2: 93.33,19.02 93.33,20.76 R1.2 | v91.4,11.4 91.85,11.8 91.85,17 93.3,18.25 93.3,18.99
  Top 0.3: IC1.5 93.28,22.26 R1.2
  Bottom 0.2: U$4.50 79.85,12.65 79.05,11.85 79.05,11.6 80.1,10.55 80.1,10.35 80.25,10.15 84.8,10.15 85.6,10.95 86.5,10.9 87.15,10.2 87.7,10.2 88.4,10.9 89.3,10.9 89.85,11.45 91.3,11.45 v91.4,11.4
MISO  (via drill 0.3)
  Top 0.152: v89.45,12.3 89.45,14.55 88.35,15.65 88.35,18.45 87.25,19.55 87.25,47.6 v84.55,50.3
  Bottom 0.152: U$6.9 88.45,50.6 87.75,51.3 84.35,51.3 84.35,50.5 v84.55,50.3 84.35,50.4 83.45,49.5 68.85,49.5 68.05,50.3 R12.2 | U$4.4 89.05,12.65 89.1,12.6 v89.45,12.3
MOSI
  Bottom 0.152: 89.4,50.15 89.25,50 U$6.8 | 89.4,50.15 89.85,50.6 98.93,50.6 98.93,20.64 97.18,18.9 97.15,18.9 96.45,18.2 89.8,18.2 88.8,17.3 88.75,17.2 88.75,15.9 88.65,15.8 U$4.5 | R11.1 66.45,50.4 66.75,50.7 67.25,50.7 67.55,51 68.65,51 68.75,51.1 71.15,51.1 71.75,51.7 87.85,51.7 89.4,50.15
N$1
  Top 0.3: IC1.1 93.35,26.88 L1.1
N$2
  Top 0.3: IC1.10 96.3,26.88 L1.2
N$4  (via drill 0.3)
  Top 0.152: R2.2 R3.1 96.25,34.1 95.45,34.1 v95.15,33.8 | v90.75,33.8 90.55,33.6 90.57,32.23 90.57,30.85 91.63,29.8 91.63,24.46 91.53,24.36 91.53,23.66 92.13,23.06 92.53,23.06 92.73,23.26 IC1.3
  Bottom 0.152: v90.75,33.8 v95.15,33.8
N$6
  Top 0.152: R3.2 94.35,32.75 Q1.3
N$7  (via drill 0.3)
  Top 0.152: v59.45,54.6 58.55,55.5 52.75,55.5 52.75,55.6 52.1,56.25 v52.1,58.5 | v50.5,60.85 50.3,61.05 50.3,62.15 U$3.21
  Bottom 0.152: v59.45,54.6 62.65,54.6 64.85,52.4 64.95,52.4 R7.1 | v50.5,60.85 51.5,59.85 51.5,59.1 v52.1,58.5
N$8  (via drill 0.3)
  Top 0.152: v56.9,56.85 v56.9,58.75
  Bottom 0.152: R8.2 62.05,52 60.05,54 59.25,54 56.85,56.4 56.85,56.8 v56.9,56.85 | v56.9,58.75 57.25,59.1 57.25,59.6 57.3,59.65 57.9,59.65 U$3.16
N$9
  Bottom 0.152: R6.1 87.5,57.2 87.75,56.95 87.75,55.9 U$6.5
N$10
  Top 0.152: R10.1 75.35,31.5 74.65,30.8 U1.7
N$11
  Top 0.152: R9.1 72.25,23.3 72.05,23.3 72.05,24.2 71.55,24.7 71.55,26.07 U1.99
N$12  (via drill 0.3)
  Top 0.152: v65.75,52.4 63.35,50 v49.25,50 | v46.35,49.7 39.85,56.2 39.9,56.25 39.9,56.55 40.15,56.8 40.15,59.6 U$3.30
  Bottom 0.152: v65.75,52.4 66.45,51.7 R11.2 | v49.25,50 48.95,49.7 v46.35,49.7
N$13  (via drill 0.3)
  Top 0.152: v59.45,53 v65.05,53 | v41.35,61.55 41.35,59.1 41.55,58.9 41.55,58.55 v42.65,57.45 | v52.95,57.25 v52.95,56.65
  Bottom 0.152: v65.05,53 66.75,53 68.05,51.7 R12.1 | v59.45,53 56.95,55.5 54.15,55.5 53,56.65 v52.95,56.65 | v41.35,61.55 40.75,62.15 40.15,62.15 U$3.29 | v42.65,57.45 52.75,57.45 v52.95,57.25
N$14  (via drill 0.3)
  Top 0.152: U1.80 62.06,24.11 62.05,24.1 v62.05,24
  Bottom 0.152: v62.05,24 62.05,23.8 62.75,23.1 U$5.P$1
N$16  (via drill 0.3)
  Top 0.152: v39.55,58 39,58.55 39,58.9 38.8,59.1 38.8,60.6 37.9,61.5 37.65,61.5 37.6,61.55 37.6,62.15 U$3.31 | v62.9,56.5 62.9,56.45 v65.75,53.6
  Bottom 0.152: v65.75,53.6 69.25,53.6 R13.1 | v39.55,58 42.9,58 43.1,57.8 61.6,57.8 v62.9,56.5
N$18  (via drill 0.3)
  Top 0.152: v59.15,55.85 v59.15,61.55
  Bottom 0.152: 59.05,55.8 59.85,55 70.65,55 R14.1 | 59.05,55.8 58.95,55.8 | v59.15,61.55 58.55,62.15 57.95,62.15 U$3.15 | v59.15,55.85 59.1,55.85 59.05,55.8
N$19  (via drill 0.3)
  Top 0.152: C9.1 U1.6 73.75,30.3 73.05,30.3 71.55,31.8 71.55,33.1 | 56.55,31.8 U1.67 | 66.05,43.2 65.95,43.1 65.95,41.7 66.05,41.6 U1.38 | 66.05,43.2 67.05,43.2 v67.05,42.8 | v70.35,39.5 71.55,38.3 71.55,33.1 | 66.05,43.2 C7.1 | v70.45,33.1 71.55,33.1
  Top 0.3: v56.55,33 56.55,31.8 C8.1
  Bottom 0.152: v70.35,39.5 v67.05,42.8 | v70.45,33.1 56.65,33.1 v56.55,33
  Bottom 0.3: L3.2 33.85,36.2 34.35,36.7 37.55,36.7 39.55,34.7 C20.+ 43.35,34.7 45.05,33 v56.55,33
N$20  (via drill 0.3)
  Top 0.152: C25.1 U1.78 60.95,26.1 60.95,26.9 59.75,28.1 59.75,36.1 59.6,36.25 | U1.18 73.78,36.3 C6.1 75.65,36.3 75.65,41.2 74.15,42.7 74.15,43.2 70.55,43.2 | 70.55,43.2 U1.29 | 70.55,43.2 C5.1 70.55,43.3 70.15,43.7 70.15,43.8 68.95,45 68.95,46.35 68.25,47.05 62.45,47.05 v62.45,43.4 63.55,43.4 C4.1 | C3.1 56.75,37.1 57.15,36.7 58.25,36.7 U1.57 58.35,36.8 59.05,36.8 59.6,36.25 | 63.55,41.5 U1.43 63.55,41.45 63.55,40.75 63.45,40.65 v63.45,40.1 | 59.6,36.25 v59.65,36.3
  Top 0.3: v56.65,38 56.65,36.8 C3.1
  Bottom 0.152: 59.8,40.75 57.15,38.1 56.75,38.1 v56.65,38 | 59.8,40.75 v62.45,43.4 | 59.65,40.8 59.75,40.8 59.8,40.75 | v59.65,36.3 60.6,36.3 63.45,39.15 v63.45,40.1
  Bottom 0.3: L2.2 33.85,41.6 34.35,42.1 37.65,42.1 39.65,40.1 C21.+ 43.45,40.1 45.55,38 v56.65,38
N$21  (via drill 0.3)
  Top 0.152: C10.1 63.05,24.1 63.5,24.55 63.55,24.55 | 63.55,24.8 63.55,24.55 | 63.55,24.8 64.05,25.3 U1.84 | 63.55,24.55 64.15,23.95 C11.1 C12.1 65.95,24 65.85,24.1 65.7,24.1 65.55,24.25 65.55,24.4 65.55,24.9 65.75,25.1 65.85,25.1 66.05,25.3 U1.88 | U1.82 63.05,25.4 63.55,24.8 | 69.55,23.3 69.55,24.3 69.7,24.45 69.7,25.05 69.55,25.2 U1.95
  Top 0.254: C14.1 69.55,23.3 66.65,23.3 66.55,23.4 65.95,23.4 C12.1
  Top 0.3: v62.85,27.4 62.85,27.2 63.05,27 63.05,26.1 U1.82
  Bottom 0.3: L4.2 33.75,30.6 34.25,31.1 37.45,31.1 39.45,29.1 C18.+ 43.25,29.1 43.85,28.5 61.75,28.5 v62.85,27.4
N$22  (via drill 0.3)
  Top 0.3: v70.25,27.4 70.25,27.3 70.55,27 70.55,26.1 U1.97 70.55,26 70.55,23.95 70.65,23.85 C17.1
  Bottom 0.3: L5.2 33.75,25.3 34.25,25.8 37.45,25.8 38.95,24.3 40.95,24.3 41.45,23.8 C19.+ 43.25,23.8 45.45,26 68.85,26 v70.25,27.4
N$29  (via drill 0.3)
  Top 0.152: v45.35,53.7 43.65,55.4 43.7,55.45 43.7,55.75 43.95,56 43.95,59.05 43.9,59.1 43.9,60.8 43.2,61.5 42.7,61.5 42.65,61.55 42.65,62.15 U$3.27
  Bottom 0.152: v45.35,53.7 57.05,53.7 59.05,51.7 61.15,51.7 61.55,51.3 62.55,51.3 62.85,51.6 63.55,51.6 63.75,51.8 R15.1
N$31  (via drill 0.3)
  Top 0.152: v71.95,15.8 71.95,14.3 R18.2
  Bottom 0.152: v71.95,15.8 71.75,16 U$5.P$19
N$147
  Bottom 0.152: U10.1 R24.1
  Bottom 0.254: U10.1 39.55,52.4 39.45,52.3 38.45,52.3 37.85,51.7 37.85,50.8 38.15,50.8 38.45,50.5 40.75,50.5 42.45,48.8 48.05,48.8 48.25,48.6 S2.3
N$148
  Bottom 0.152: U10.2 41.7,51.13 R23.1
  Bottom 0.254: R23.1 41.75,51.1 41.75,50.2 42.05,49.9 45.65,49.9 46.75,51 48.25,51 S2.4
N$149  (via drill 0.3)
  Top 0.3: v32.45,53.6 v36.25,49.8
  Bottom 0.3: v36.25,49.8 37.95,49.8 38.05,49.9 39.55,49.9 U10.3 | v32.45,53.6 31.35,53.6 31.15,53.4 31.15,52.4 R22.1
NCS  (via drill 0.3)
  Top 0.152: v98.3,22.9 98.3,15.85 v92.25,9.8 | v97.5,25.55 v97.5,31.8 | v90.9,34.65 90.9,53.25 90.7,53.45 90.7,54.6 v88.4,56.9 | v91.1,9.75 89.55,9.75 88.2,11.1 v88.2,12
  Bottom 0.152: v88.2,12 88.2,12.15 88.25,12.2 U$4.8 | v98.3,22.9 98.3,24.75 v97.5,25.55 | v97.5,31.8 97.5,32.65 95.5,34.65 v90.9,34.65 | v88.4,56.9 88.4,56.85 88.45,56.8 U$6.6 | v92.25,9.8 92.2,9.75 v91.1,9.75
P1.2  (via drill 0.3)
  Top 0.152: v87.05,56.9 87.25,57.1 87.25,58.1 88.65,59.5 92.95,59.5 92.95,54 94.95,52 95.15,52 SV2.4
  Bottom 0.152: v87.05,56.9 87.15,56.9 U$6.4
RED0  (via drill 0.3)
  Top 0.152: v85.95,16.45 85.95,16.25 87.95,14.25 87.95,13.95 88.85,13.05 88.85,11.55 89.05,11.35 89.05,10.85 89.6,10.3 90.55,10.3 90.7,10.45 90.7,11.25 90.5,11.45 90.5,15.15 89.45,16.2 89.45,19.7 88.65,20.5 v88.65,21.4 | v69.25,31.2 69.35,31.3 69.35,34.3 69.25,34.4 69.25,34.8 69.35,34.9 69.35,40
  Top 0.254: U1.30 70.05,41.5 70.05,40.6 69.45,40 69.35,40 68.05,40 67.55,39.5 64.65,39.5 64,38.85 61.85,38.85 60.7,40 59.6,40 59.45,40.1 58.85,40.7 50.35,40.7 50.35,29 36.35,15 36.35,13.9 35.15,12.7 35.15,11.8 U$2.34
  Bottom 0.152: v88.65,21.4 82.65,27.4 73.05,27.4 v69.25,31.2 | v85.95,16.45 85.85,16.3 U$4.19
RED1  (via drill 0.3)
  Top 0.152: v86.1,12.3 86.45,12.3 87.05,11.7 87.05,11.4 86.85,11.2 86.85,9.85 86.45,9.45 73.35,9.45 v73.35,13.4 | v69.55,42.8 69.55,42.7 69.45,42.6 69.45,41.7 69.55,41.6 U1.31 | v54.45,36.1 54.15,35.8 v54.15,14.6
  Bottom 0.152: v73.35,13.4 72.55,14.5 54.15,14.5 | 54.15,14.5 44.45,14.5 43.35,15.6 34.05,15.6 32.75,14.3 32.65,14.3 U$2.35 | v86.1,12.3 86.1,12.5 86.25,12.6 U$4.18 | v69.55,42.8 68.95,43.4 65.85,43.4 58.55,36.1 v54.45,36.1 | 54.15,14.5 v54.15,14.6
RED2  (via drill 0.3)
  Top 0.152: v86.6,17.88 86.45,17.88 86.45,33.5 v76.35,43.6 | v69.55,43.6 68.95,43 68.95,41.6 U1.32 | v38.95,41.7 38.95,18.6 35.65,15.3 35.65,14.7 35.25,14.3 U$2.33
  Bottom 0.152: v86.6,17.88 86.6,16.25 86.25,15.9 U$4.17 | 69.85,43.6 v76.35,43.6 | v38.95,41.7 41.85,44.6 68.85,44.6 69.85,43.6 | 69.85,43.6 v69.55,43.6
RED3  (via drill 0.3)
  Top 0.152: v86.35,11.5 86.4,11.45 86.4,9.95 86.25,9.8 77.75,9.8 77.75,10.7 77.55,10.9 77.55,11.9 v76.9,12.55 | v68.65,44 68.55,43.9 68.55,42.7 68.45,42.6 68.45,41.6 U1.33 | v52.75,13.2 v52.75,37.1
  Bottom 0.152: v86.35,11.5 86.65,11.8 U$4.16' | v76.9,12.55 76.85,12.6 72.85,12.6 72.35,13.1 52.75,13.1 | 52.75,13.1 38.85,13.1 37.75,14.2 U$2.31 | v68.65,44 63.85,44 56.95,37.1 v52.75,37.1 | 52.75,13.1 v52.75,13.2
RED4  (via drill 0.3)
  Top 0.152: v64.95,43.4 64.95,46.25 67.75,46.25 68.15,46 68.15,45 68.05,44.9 68.05,41.6 U1.34 | v60.25,39.4 60.85,38.8 v60.85,27.8 | v50.45,27.3 38.75,15.6 38.75,12.8 37.75,11.8 U$2.32 v37.7,12.95 | v21.15,9.7 21.15,12.6 v21.5,12.95 | v30.9,13 31.85,13 v32,13.15 | v88.6,9.7 87.6,9.7 87.4,9.9 v87.4,10.85
  Bottom 0.152: v64.95,43.4 64.25,43.4 v60.25,39.4 | v60.85,27.8 60.35,27.3 v50.45,27.3 | v21.15,9.7 21.4,9.45 88.35,9.45 v88.6,9.7 | v21.5,12.95 23,12.95 23.05,13 24.4,13 24.45,13.05 25.55,13.05 25.6,13 26.95,13 27,13.05 28.1,13.05 28.15,13 29.5,13 29.55,13.05 30.6,13.05 30.65,13 v30.9,13 | v32,13.15 32.2,12.95 v37.7,12.95 | v87.4,10.85 87.35,10.9 87.05,11.25 87,11.3 87,12.65 87.05,12.7 U$4.14
RED5  (via drill 0.3)
  Top 0.152: v87.15,16.45 87.15,16.75 86.7,17.2 86.4,17.2 85.25,18.35 85.25,33.9 v73.95,45.2 | v67.55,45.2 67.45,45.1 67.45,43.2 67.65,43 67.65,42.3 67.45,42.1 67.45,41.6 U1.35
  Bottom 0.152: v87.15,16.45 87.05,16.35 U$4.13 | v73.95,45.2 v67.55,45.2
RED6  (via drill 0.3)
  Top 0.152: v67.35,40.15 67.05,40.45 67.05,41.5 U1.36 | v68.8,37.2 v68.8,39.4 | v88.35,39.45 88.55,39.25 v88.55,36.65 | v89.75,36.65 89.75,25.1 89.3,24.65 v89.3,21.95 | v91.05,12.65 91.05,15.15 90.3,15.9 90.3,21.45 v90.6,21.75
  Bottom 0.152: v91.05,12.65 91.05,12 90.85,11.8 89.65,11.8 89.2,11.35 87.75,11.35 87.35,11.75 87.35,12.5 87.45,12.6 U$4.12 | v67.35,40.15 68.1,39.4 v68.8,39.4 | v68.8,37.2 70.15,37.2 71.85,38.9 71.85,39.5 72.3,39.95 82,39.95 82.5,39.45 v88.35,39.45 | v89.75,36.65 v88.55,36.65 | v89.3,21.95 89.5,21.75 v90.6,21.75
RED7  (via drill 0.3)
  Top 0.152: v82.71,19.23 82.71,21.46 82.75,21.5 82.81,21.55 v82.8,21.55 | v62.8,29 v62.8,36.15 | v68.25,29 68.25,27.7 68.55,27.4 69.05,27.4 69.9,28.25 70.6,28.25 v71.45,27.4 | v82.85,26.3 83.55,25.6 v83.55,24.2 | v66.55,40.1 66.55,40.35 66.45,40.45 66.45,40.65 66.55,40.75 66.55,41.5 U1.37 | v66.35,37 v66.35,38.9
  Bottom 0.152: U$4.11 87.45,15.95 87.7,16.2 87.7,17.4 87.15,17.9 87.15,18.83 86.8,19.18 86.8,19.19 86.25,19.69 83.09,19.69 82.8,19.4 v82.71,19.23 | v66.35,37 65.5,36.15 v62.8,36.15 | v62.8,29 63,29.2 68.05,29.2 v68.25,29 | v71.45,27.4 72.15,26.7 73.05,26.7 73.45,26.3 v82.85,26.3 | v83.55,24.2 84.95,24.2 86.7,22.45 86.7,22.15 86.1,21.55 85.6,21.55 85.4,21.75 83,21.75 v82.8,21.55 | v66.55,40.1 66.55,39.1 v66.35,38.9
RESET  (via drill 0.3)
  Top 0.152: v87.7,18.25 86.85,19.1 86.85,46.7 83.2,50.35 | 83.2,50.35 83.15,50.4 83.15,52.5 v85.35,54.7 | v72.35,47.6 75.05,50.3 83.15,50.3 83.2,50.35
  Bottom 0.152: v85.35,54.7 85.85,55.2 U$6.2 | U$4.9 87.85,15.9 88.05,16.1 88.05,17.95 v87.7,18.25 | U$6.2 | v72.35,47.6 63.35,47.6 63.35,49.3 62.05,50.6 R8.1
RST
  Bottom 0.152: C22.1 R5.1 87.8,47.75 87.8,48.8 | 87.8,48.8 U$6.10 | 87.8,48.8 93.05,48.8 93.65,49.4 SV2.5
SCDT  (via drill 0.3)
  Top 0.152: v74.15,41.9 71.95,39.7 71.95,32.1 72.65,31.4 73.75,31.4 U1.8
  Bottom 0.152: v74.15,41.9 76.95,41.9 76.95,43.8 71.95,48.8 64.95,48.8 R7.2
SCLK  (via drill 0.3)
  Top 0.152: v88.25,19.35 87.65,19.9 87.65,54.5 | 87.65,54.5 87.65,58 88.75,59.1 89.55,59.1 v89.55,57 | 87.65,54.5 v83.75,50.6
  Bottom 0.152: 70.65,50.5 69.25,50.5 R13.2 | v89.55,57 89.15,56.6 89.15,55.9 U$6.7 | U$4.7 88.25,15.85 88.4,16 88.4,19.15 v88.25,19.35 | 70.65,50.5 70.75,50.6 v83.75,50.6 | 70.65,50.5 R14.2
ST  (via drill 0.3)
  Top 0.152: v65.75,48.2 69.65,48.2 77.65,40.2 77.65,37 77.95,36.7 77.95,33.5 76.45,32 76.45,29.8 75.55,28.9 73.85,28.9 73.85,28.8 U1.3
  Bottom 0.152: v65.75,48.2 63.75,48.2 R15.2
SYS_5V  (via drill 0.3)
  Top 0.152: v90.63,25.16 90.63,24.26 90.43,24.26 C1.1 | 71.1,15.75 71.05,15.7 71.05,14.5 70.75,14.2 70.65,14.3 R18.1 | 71.1,15.75 71.25,15.9 | v70.95,15.8 71.05,15.8 71.1,15.75 | v33.05,44 26.95,37.9 IC2.3 | 66.3,52.15 66.95,52.8 66.95,56.8 68.05,57.9 68.05,59.6 U$3.8 68.05,59.7 68.05,62.15 U$3.7 | v60.05,45.9 60.05,46.85 61.7,48.5 62.65,48.5 66.3,52.15 | v83.55,31.6 82.05,33.1 82.05,36.3 66.35,52 66.35,52.1 66.3,52.15
  Top 0.3: IC1.7 IC1.6 96.33,22.16 96.33,21.66 v96.23,21.56 | v92.33,23.76 IC1.2 | C15.1 IC2.3
  Bottom 0.152: v92.33,23.76 92.23,23.86 92.13,23.86 92.13,23.96 91.63,24.46 91.33,24.46 v90.63,25.16 83.55,30.1 v83.55,31.6 | v70.95,15.8 70.95,16 71.25,16.3 U$5.P$18 71.25,18.4 73.65,20.8 82.2,20.8 82.25,20.75 90.45,20.75 90.95,21.25 93.23,21.26 93.73,21.76 94.13,21.76 94.23,21.86 | v33.05,44 34.95,45.9 v60.05,45.9
  Bottom 0.3: v92.33,23.76 94.23,21.86 94.53,21.56 v96.23,21.56
TEST
  Bottom 0.152: U$6.11 87.15,48.7 86.35,48.7 85.35,47.7 85.35,45.4 92.15,45.4 93.55,46.8 95.15,46.8 SV2.6
TMDS_CLOCK+  (via drill 0.3)
  Top 0.152: U1.93 68.54,25.29 v67.95,24.7
  Bottom 0.152: v67.95,24.7 67.55,24.3 67.55,18.9 67.25,18.6 U$5.P$10
TMDS_CLOCK-  (via drill 0.3)
  Top 0.152: U1.94 v69.05,24.9
  Bottom 0.152: v69.05,24.9 69.05,24.8 67.95,23.7 67.95,18.9 68.25,18.6 U$5.P$12
TMDS_DATA0+  (via drill 0.3)
  Top 0.152: U1.90 67.04,25.29 66.75,25 66.5,25 v66.1,24.6
  Bottom 0.152: v66.1,24.6 65.85,24.35 65.85,18.5 65.75,18.4 U$5.P$7
TMDS_DATA0-  (via drill 0.3)
  Top 0.152: U1.91 67.55,25.2 66.85,24.5 v66.85,24.4
  Bottom 0.152: U$5.P$9 66.75,18.5 66.65,18.6 66.65,24.2 v66.85,24.4
TMDS_DATA1+  (via drill 0.3)
  Top 0.152: v64.45,24.9 64.45,25 64.55,25.1 U1.85
  Bottom 0.152: U$5.P$4 64.25,18.7 64.45,18.9 64.45,23.85 64.4,23.9 64.4,24.55 64.45,24.6 v64.45,24.9
TMDS_DATA1-  (via drill 0.3)
  Top 0.152: v64.95,24.2 64.95,24.5 65.05,24.6 U1.86
  Bottom 0.152: U$5.P$6 65.25,18.7 64.95,19 v64.95,24.2
TMDS_DATA2-  (via drill 0.3)
  Top 0.152: v62.75,24.75 62.55,24.95 U1.81
  Bottom 0.152: U$5.P$3 63.75,23.5 63.75,23.55 62.75,24.55 v62.75,24.75
VDD  (via drill 0.3)
  Top 0.152: R9.2 72.25,22 77.35,22 77.35,28.8 78.15,29.6 78.15,30.9 v77.95,31.1 77.75,31.3 77.15,31.3 77.15,31.5 R10.2 | 93.15,36 93.15,44.7 v91.85,46 91.85,53.9 88.95,56.8 v88.95,57.6 | 93.15,36 93.15,35.2 93.35,35 R4.2 | 93.15,36 v93.05,36 | v57.75,52.1 v61.25,55.6
  Top 0.3: 24.55,39.6 24.55,35.65 C16.1 | 24.55,39.6 IC2.4 | v24.65,39.6 24.55,39.6 | v31.55,39.5 v31.55,34.2 v31.55,28.6 v31.55,23.3 | v33.75,39.7 v33.75,47.1
  Bottom 0.152: U10.8 R22.2 | 83.65,55.8 81.95,55.8 C24.1 81.95,55.7 81.75,55.5 75.25,55.5 75.15,55.4 61.45,55.4 v61.25,55.6 | 83.65,55.8 85.15,55.8 U$6.1 85.25,55.9 85.25,57.8 86.5,59.05 R6.2 88.15,59.05 88.95,58.25 v88.95,57.6 | 83.65,55.8 C23.1 | v91.85,46 90.9,46.95 89.3,46.95 88.75,46.4 87.85,46.4 R5.2 | v77.95,31.1 79.05,32.2 88.45,32.2 89.85,33.6 89.85,36 v93.05,36 | v57.75,52.1 57.65,52.2 57.55,52.2
  Bottom 0.254: R23.2 43.05,51.1 43.05,52.4 R24.2 | R24.2 42.95,52.5 42.95,53.3 42.65,53.6 37.35,53.6 36.25,52.5 34.75,52.5 U10.8 | 31.7,47.45 30.95,48.2 30.95,48.5 31.05,48.5 R17.2 31.15,48.6 31.15,49.9 R16.2 31.05,50 30.95,50 30.95,50.3 31.75,51.1 31.95,51.1 32.35,51.5 32.35,52.4 R22.2 | 31.7,47.45 31.95,47.2 33.75,47.2 38.15,47.2 38.25,47.1 C13.1 | 31.45,47.4 31.65,47.4 31.7,47.45 | 57.55,52.2 57.35,52.4 56.15,52.4 55.85,52.1 55.25,52.1 54.95,52.4 R24.2
  Bottom 0.3: 31.55,39.6 v24.65,39.6 | 31.55,39.6 L2.1 33.65,39.6 v33.75,39.7 | v31.55,34.2 L3.1 | v31.55,39.5 31.55,39.6 | v31.55,28.6 L4.1 | v31.55,23.3 L5.1 | v33.75,47.1 33.75,47.2
VSYNC  (via drill 0.3)
  Top 0.152: v58.15,41.4 58.15,43.4 60.55,43.4 61.45,42.5 61.45,41.7 61.55,41.6 U1.47 | v55.45,38.7 53.35,36.6 v53.35,24.9 | v50.65,22.2 42.85,14.4 42.85,14.3 U$2.27 | v80.3,17.15 80.3,17.3 79.05,18.55 78.25,18.55 v77.8,19 | v74.95,17.7 74.65,17.7 73.9,18.45 v73.8,18.45 | v72.25,18.6 71.6,19.25 71.6,19.5 70.95,20.15 70.9,20.15 v70.7,20.35 | v68.5,20.35 67.65,21.2 62.75,21.2 62.5,21.45 62.4,21.45 v62.2,21.65
  Bottom 0.152: v55.45,38.7 v58.15,41.4 | v53.35,24.9 v50.65,22.2 50.9,21.95 56.65,21.95 56.9,22.2 58.35,22.2 58.95,21.6 59,21.65 v62.2,21.65 | U$4.45 80.65,16 80.25,16.4 80.25,17.1 v80.3,17.15 | v73.8,18.45 73.65,18.6 v72.25,18.6 | v68.5,20.35 v70.7,20.35 | v74.95,17.7 75.2,17.45 76.8,18 v77.8,19

### Text on the board
tNames: Rev A0 | Replicape display